# EAGLE design modul_analogin (EAGLE 7.7.0)

## Sheet 1 of 5
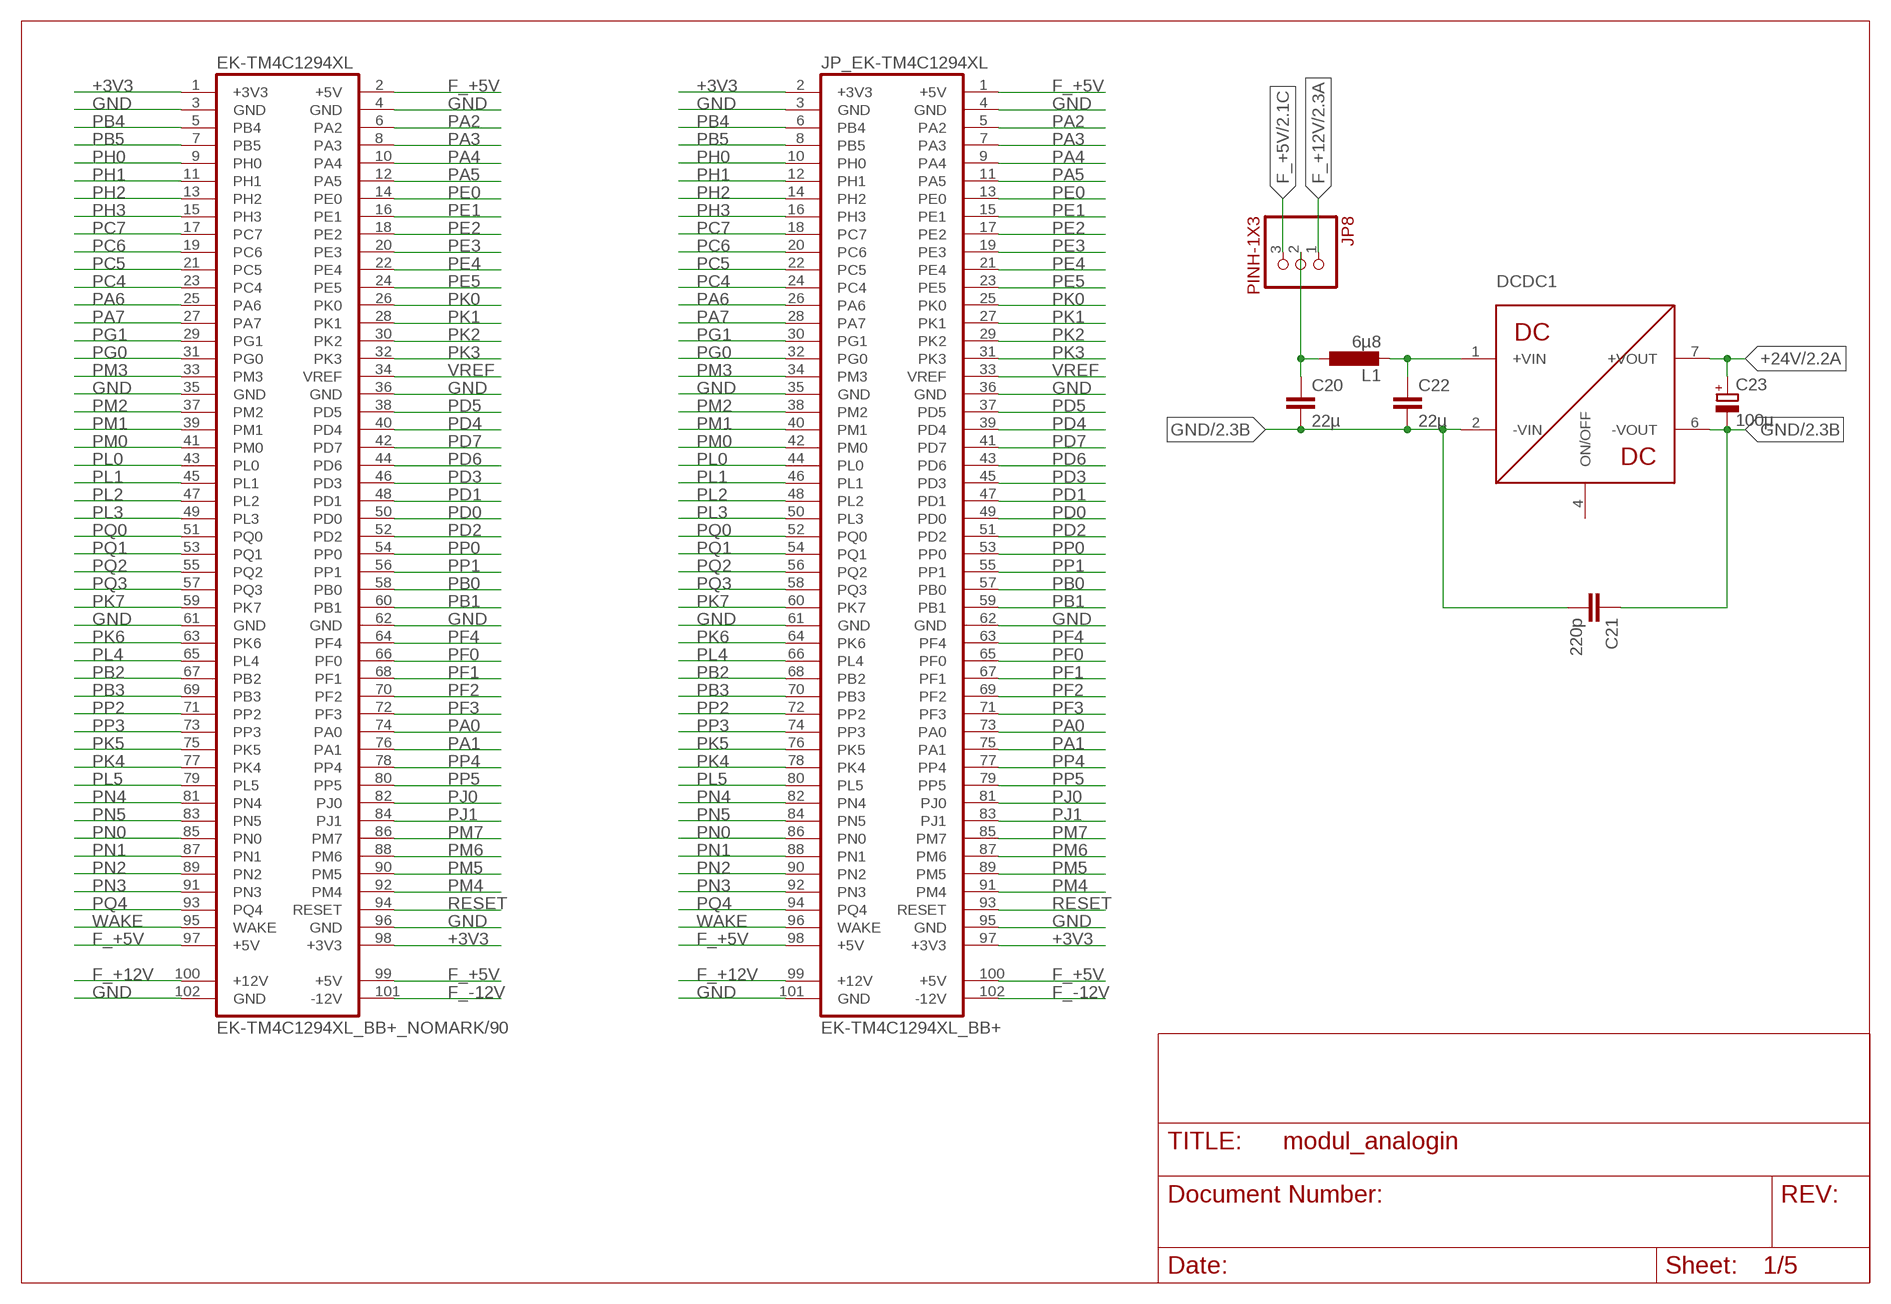
[diagram p0: schematic, sheet 1]

### Parts
C20  22µ  C-EUC1206  [C1206]
C21  220p  C-EUC1808  [C1808]
C22  22µ  C-EUC1206  [C1206]
C23  100µ  CPOL-EUE2.5-6  [E2,5-6]
DCDC1  TDN3WI  [TDN_XWI]
EK-TM4C1294XL  EK-TM4C1294XL_BB+_NOMARK/90  [EK-TM4C1294XL_BB+_NOMARK/90]
JP8  PINH-1X3  [1X3]
JP_EK-TM4C1294XL  EK-TM4C1294XL_BB+  [EK-TM4C1294XL_BB+]
L1  6µ8  L-EUL1812  [L1812]

### Nets
+3V3: EK-TM4C1294XL.1(+3V3) EK-TM4C1294XL.98(+3V3) JP_EK-TM4C1294XL.2(+3V3) JP_EK-TM4C1294XL.97(+3V3) ; also sheet 4,5
+24V: C23.+ DCDC1.7(+VOUT) ; also sheet 2
+VIN: C22.1 DCDC1.1(+VIN) L1.2
F_+5V: EK-TM4C1294XL.2(+5V) EK-TM4C1294XL.97(+5V) EK-TM4C1294XL.99(+5V) JP8.3 JP_EK-TM4C1294XL.1(+5V) JP_EK-TM4C1294XL.98(+5V) JP_EK-TM4C1294XL.100(+5V) ; also sheet 2,3
F_+12V: EK-TM4C1294XL.100(+12V) JP8.1 JP_EK-TM4C1294XL.99(+12V) ; also sheet 2,4,5
F_-12V: EK-TM4C1294XL.101(-12V) JP_EK-TM4C1294XL.102(-12V) ; also sheet 2,4,5
GND: C20.2 C21.1 C21.2 C22.2 C23.- DCDC1.2(-VIN) DCDC1.6(-VOUT) EK-TM4C1294XL.3(GND) EK-TM4C1294XL.4(GND) EK-TM4C1294XL.35(GND) EK-TM4C1294XL.36(GND) EK-TM4C1294XL.61(GND) EK-TM4C1294XL.62(GND) EK-TM4C1294XL.96(GND) EK-TM4C1294XL.102(GND) JP_EK-TM4C1294XL.3(GND) JP_EK-TM4C1294XL.4(GND) JP_EK-TM4C1294XL.35(GND) JP_EK-TM4C1294XL.36(GND) JP_EK-TM4C1294XL.61(GND) JP_EK-TM4C1294XL.62(GND) JP_EK-TM4C1294XL.95(GND) JP_EK-TM4C1294XL.101(GND) ; also sheet 2,3,4,5
N$24: C20.1 JP8.2 L1.1
PA0: EK-TM4C1294XL.74(PA0) JP_EK-TM4C1294XL.73(PA0)
PA1: EK-TM4C1294XL.76(PA1) JP_EK-TM4C1294XL.75(PA1)
PA2: EK-TM4C1294XL.6(PA2) JP_EK-TM4C1294XL.5(PA2)
PA3: EK-TM4C1294XL.8(PA3) JP_EK-TM4C1294XL.7(PA3)
PA4: EK-TM4C1294XL.10(PA4) JP_EK-TM4C1294XL.9(PA4)
PA5: EK-TM4C1294XL.12(PA5) JP_EK-TM4C1294XL.11(PA5)
PA6: EK-TM4C1294XL.25(PA6) JP_EK-TM4C1294XL.26(PA6)
PA7: EK-TM4C1294XL.27(PA7) JP_EK-TM4C1294XL.28(PA7)
PB0: EK-TM4C1294XL.58(PB0) JP_EK-TM4C1294XL.57(PB0)
PB1: EK-TM4C1294XL.60(PB1) JP_EK-TM4C1294XL.59(PB1)
PB2: EK-TM4C1294XL.67(PB2) JP_EK-TM4C1294XL.68(PB2)
PB3: EK-TM4C1294XL.69(PB3) JP_EK-TM4C1294XL.70(PB3)
PB4: EK-TM4C1294XL.5(PB4) JP_EK-TM4C1294XL.6(PB4) ; also sheet 3
PB5: EK-TM4C1294XL.7(PB5) JP_EK-TM4C1294XL.8(PB5) ; also sheet 3
PC4: EK-TM4C1294XL.23(PC4) JP_EK-TM4C1294XL.24(PC4)
PC5: EK-TM4C1294XL.21(PC5) JP_EK-TM4C1294XL.22(PC5)
PC6: EK-TM4C1294XL.19(PC6) JP_EK-TM4C1294XL.20(PC6)
PC7: EK-TM4C1294XL.17(PC7) JP_EK-TM4C1294XL.18(PC7)
PD0: EK-TM4C1294XL.50(PD0) JP_EK-TM4C1294XL.49(PD0) ; also sheet 3
PD1: EK-TM4C1294XL.48(PD1) JP_EK-TM4C1294XL.47(PD1) ; also sheet 3
PD2: EK-TM4C1294XL.52(PD2) JP_EK-TM4C1294XL.51(PD2) ; also sheet 3
PD3: EK-TM4C1294XL.46(PD3) JP_EK-TM4C1294XL.45(PD3) ; also sheet 3
PD4: EK-TM4C1294XL.40(PD4) JP_EK-TM4C1294XL.39(PD4) ; also sheet 3
PD5: EK-TM4C1294XL.38(PD5) JP_EK-TM4C1294XL.37(PD5) ; also sheet 3
PD6: EK-TM4C1294XL.44(PD6) JP_EK-TM4C1294XL.43(PD6) ; also sheet 3
PD7: EK-TM4C1294XL.42(PD7) JP_EK-TM4C1294XL.41(PD7) ; also sheet 3
PE0: EK-TM4C1294XL.14(PE0) JP_EK-TM4C1294XL.13(PE0) ; also sheet 3
PE1: EK-TM4C1294XL.16(PE1) JP_EK-TM4C1294XL.15(PE1) ; also sheet 3
PE2: EK-TM4C1294XL.18(PE2) JP_EK-TM4C1294XL.17(PE2) ; also sheet 3
PE3: EK-TM4C1294XL.20(PE3) JP_EK-TM4C1294XL.19(PE3) ; also sheet 3
PE4: EK-TM4C1294XL.22(PE4) JP_EK-TM4C1294XL.21(PE4) ; also sheet 3
PE5: EK-TM4C1294XL.24(PE5) JP_EK-TM4C1294XL.23(PE5) ; also sheet 3
PF0: EK-TM4C1294XL.66(PF0) JP_EK-TM4C1294XL.65(PF0)
PF1: EK-TM4C1294XL.68(PF1) JP_EK-TM4C1294XL.67(PF1)
PF2: EK-TM4C1294XL.70(PF2) JP_EK-TM4C1294XL.69(PF2)
PF3: EK-TM4C1294XL.72(PF3) JP_EK-TM4C1294XL.71(PF3)
PF4: EK-TM4C1294XL.64(PF4) JP_EK-TM4C1294XL.63(PF4)
PG0: EK-TM4C1294XL.31(PG0) JP_EK-TM4C1294XL.32(PG0)
PG1: EK-TM4C1294XL.29(PG1) JP_EK-TM4C1294XL.30(PG1)
PH0: EK-TM4C1294XL.9(PH0) JP_EK-TM4C1294XL.10(PH0)
PH1: EK-TM4C1294XL.11(PH1) JP_EK-TM4C1294XL.12(PH1)
PH2: EK-TM4C1294XL.13(PH2) JP_EK-TM4C1294XL.14(PH2)
PH3: EK-TM4C1294XL.15(PH3) JP_EK-TM4C1294XL.16(PH3)
PJ0: EK-TM4C1294XL.82(PJ0) JP_EK-TM4C1294XL.81(PJ0)
PJ1: EK-TM4C1294XL.84(PJ1) JP_EK-TM4C1294XL.83(PJ1)
PK0: EK-TM4C1294XL.26(PK0) JP_EK-TM4C1294XL.25(PK0)
PK1: EK-TM4C1294XL.28(PK1) JP_EK-TM4C1294XL.27(PK1)
PK2: EK-TM4C1294XL.30(PK2) JP_EK-TM4C1294XL.29(PK2)
PK3: EK-TM4C1294XL.32(PK3) JP_EK-TM4C1294XL.31(PK3)
PK4: EK-TM4C1294XL.77(PK4) JP_EK-TM4C1294XL.78(PK4)
PK5: EK-TM4C1294XL.75(PK5) JP_EK-TM4C1294XL.76(PK5)
PK6: EK-TM4C1294XL.63(PK6) JP_EK-TM4C1294XL.64(PK6)
PK7: EK-TM4C1294XL.59(PK7) JP_EK-TM4C1294XL.60(PK7)
PL0: EK-TM4C1294XL.43(PL0) JP_EK-TM4C1294XL.44(PL0)
PL1: EK-TM4C1294XL.45(PL1) JP_EK-TM4C1294XL.46(PL1)
PL2: EK-TM4C1294XL.47(PL2) JP_EK-TM4C1294XL.48(PL2)
PL3: EK-TM4C1294XL.49(PL3) JP_EK-TM4C1294XL.50(PL3)
PL4: EK-TM4C1294XL.65(PL4) JP_EK-TM4C1294XL.66(PL4)
PL5: EK-TM4C1294XL.79(PL5) JP_EK-TM4C1294XL.80(PL5)
PM0: EK-TM4C1294XL.41(PM0) JP_EK-TM4C1294XL.42(PM0)
PM1: EK-TM4C1294XL.39(PM1) JP_EK-TM4C1294XL.40(PM1)
PM2: EK-TM4C1294XL.37(PM2) JP_EK-TM4C1294XL.38(PM2)
PM3: EK-TM4C1294XL.33(PM3) JP_EK-TM4C1294XL.34(PM3)
PM4: EK-TM4C1294XL.92(PM4) JP_EK-TM4C1294XL.91(PM4)
PM5: EK-TM4C1294XL.90(PM5) JP_EK-TM4C1294XL.89(PM5)
PM6: EK-TM4C1294XL.88(PM6) JP_EK-TM4C1294XL.87(PM6)
PM7: EK-TM4C1294XL.86(PM7) JP_EK-TM4C1294XL.85(PM7)
PN0: EK-TM4C1294XL.85(PN0) JP_EK-TM4C1294XL.86(PN0)
PN1: EK-TM4C1294XL.87(PN1) JP_EK-TM4C1294XL.88(PN1)
PN2: EK-TM4C1294XL.89(PN2) JP_EK-TM4C1294XL.90(PN2)
PN3: EK-TM4C1294XL.91(PN3) JP_EK-TM4C1294XL.92(PN3)
PN4: EK-TM4C1294XL.81(PN4) JP_EK-TM4C1294XL.82(PN4)
PN5: EK-TM4C1294XL.83(PN5) JP_EK-TM4C1294XL.84(PN5)
PP0: EK-TM4C1294XL.54(PP0) JP_EK-TM4C1294XL.53(PP0)
PP1: EK-TM4C1294XL.56(PP1) JP_EK-TM4C1294XL.55(PP1)
PP2: EK-TM4C1294XL.71(PP2) JP_EK-TM4C1294XL.72(PP2)
PP3: EK-TM4C1294XL.73(PP3) JP_EK-TM4C1294XL.74(PP3)
PP4: EK-TM4C1294XL.78(PP4) JP_EK-TM4C1294XL.77(PP4)
PP5: EK-TM4C1294XL.80(PP5) JP_EK-TM4C1294XL.79(PP5)
PQ0: EK-TM4C1294XL.51(PQ0) JP_EK-TM4C1294XL.52(PQ0)
PQ1: EK-TM4C1294XL.53(PQ1) JP_EK-TM4C1294XL.54(PQ1)
PQ2: EK-TM4C1294XL.55(PQ2) JP_EK-TM4C1294XL.56(PQ2)
PQ3: EK-TM4C1294XL.57(PQ3) JP_EK-TM4C1294XL.58(PQ3)
PQ4: EK-TM4C1294XL.93(PQ4) JP_EK-TM4C1294XL.94(PQ4)
RESET: EK-TM4C1294XL.94(RESET) JP_EK-TM4C1294XL.93(RESET)
VREF: EK-TM4C1294XL.34(VREF) JP_EK-TM4C1294XL.33(VREF)
WAKE: EK-TM4C1294XL.95(WAKE) JP_EK-TM4C1294XL.96(WAKE)
Unconnected: DCDC1.4(ON/OFF)

## Sheet 2 of 5
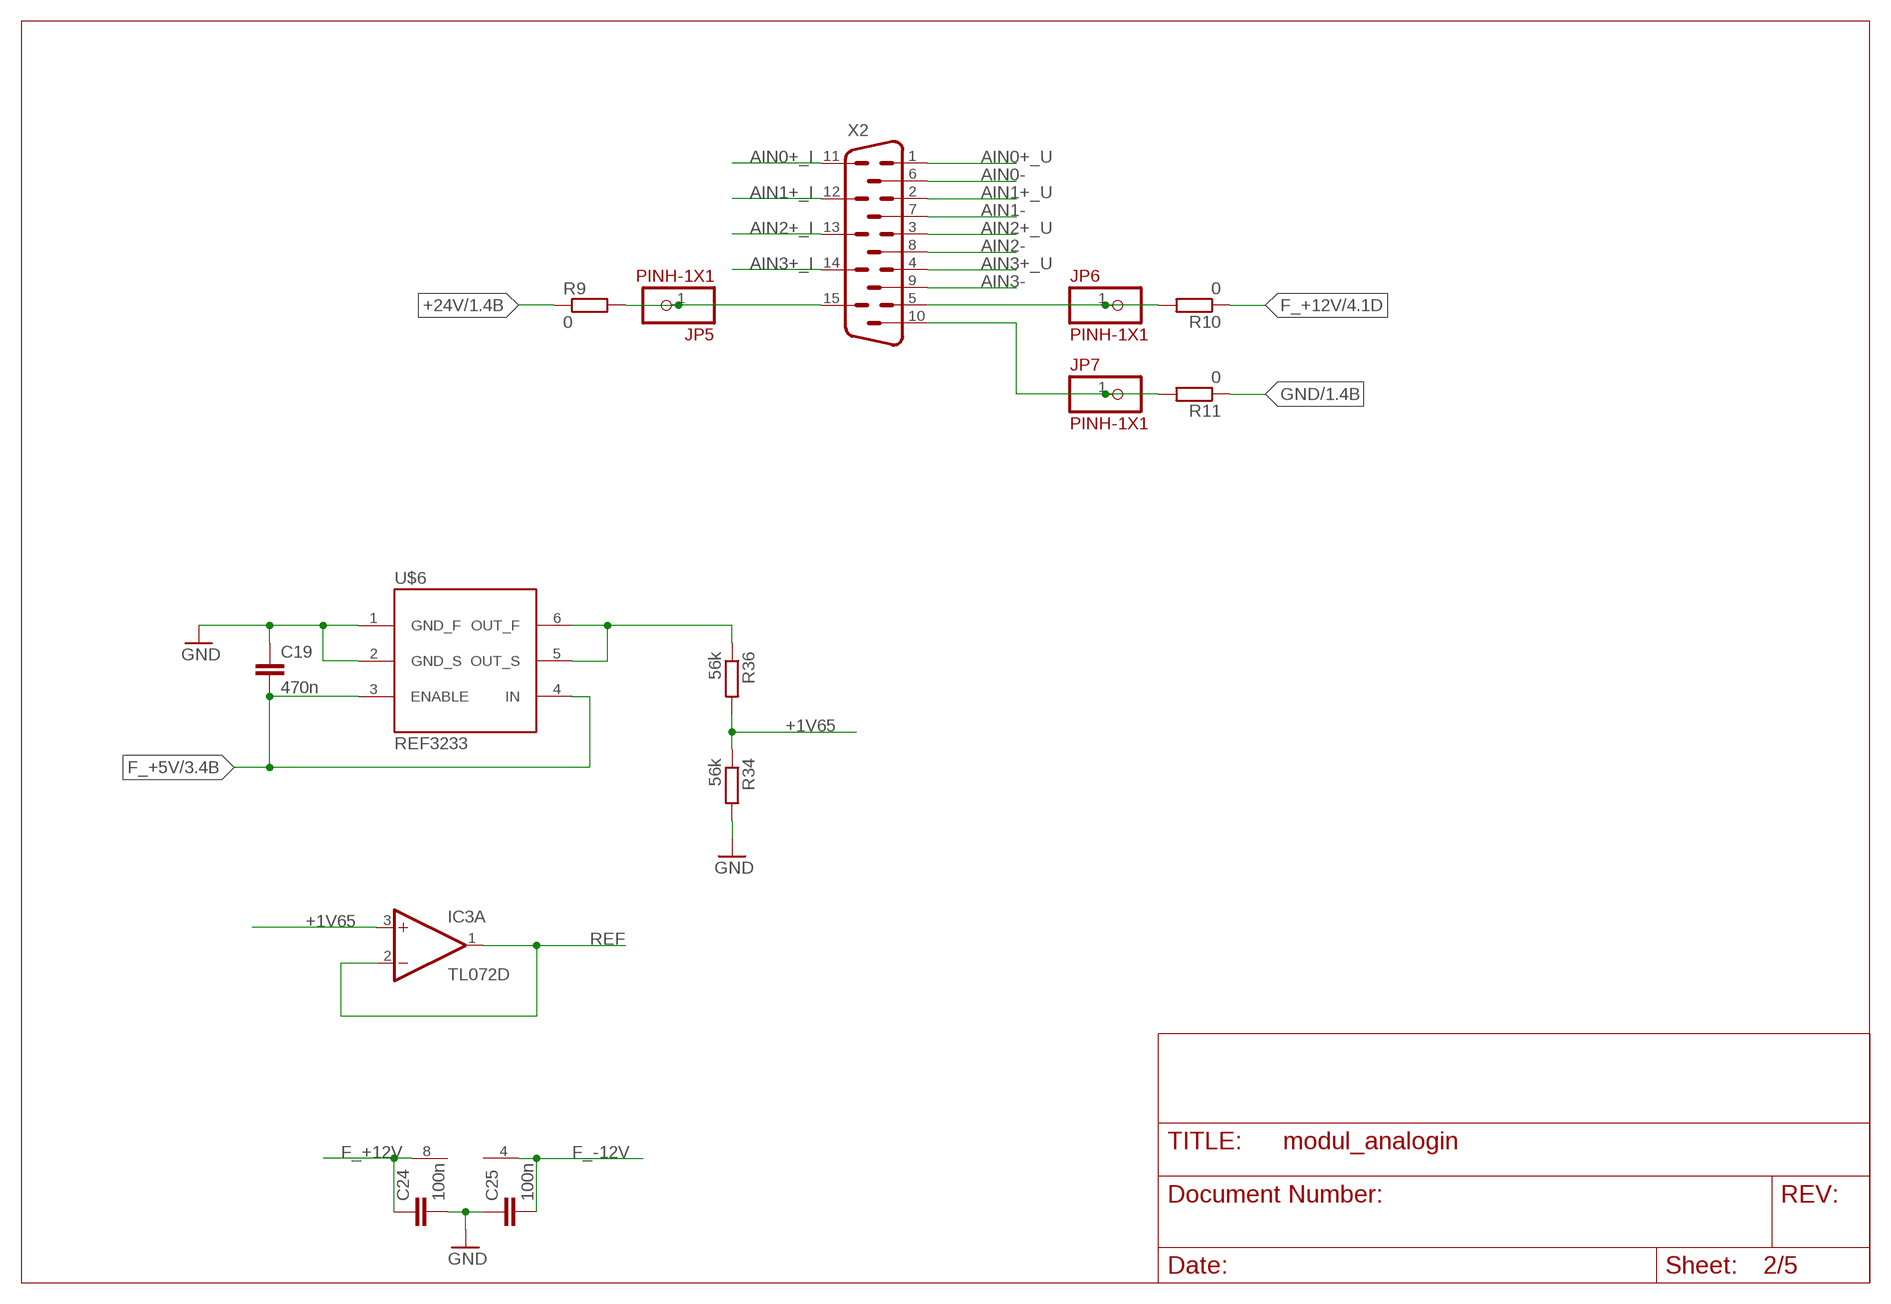
[diagram p1: schematic, sheet 2]

### Parts
C19  470n  C-EUC0805  [C0805]
C24  100n  C-EUC0805  [C0805]
C25  100n  C-EUC0805  [C0805]
IC3  TL072D  [SO08]
JP5  PINH-1X1  [1X1]
JP6  PINH-1X1  [1X1]
JP7  PINH-1X1  [1X1]
R9  0  R-EU_R0805  [R0805]
R10  0  R-EU_R0805  [R0805]
R11  0  R-EU_R0805  [R0805]
R34  56k  R-EU_R0805  [R0805]
R36  56k  R-EU_R0805  [R0805]
U$6  REF3233  [SOT-23-6_DBV]
X2  HM15H  [HDM15H]

### Nets
+1V65: IC3.3(A:+IN) R34.1 R36.2
+24V: R9.1 ; also sheet 1
AIN0+_I: X2.11 ; also sheet 4
AIN0+_U: X2.1 ; also sheet 4
AIN0-: X2.6 ; also sheet 4
AIN1+_I: X2.12 ; also sheet 4
AIN1+_U: X2.2 ; also sheet 4
AIN1-: X2.7 ; also sheet 4
AIN2+_I: X2.13 ; also sheet 5
AIN2+_U: X2.3 ; also sheet 5
AIN2-: X2.8 ; also sheet 5
AIN3+_I: X2.14 ; also sheet 5
AIN3+_U: X2.4 ; also sheet 5
AIN3-: X2.9 ; also sheet 5
F_+5V: C19.2 U$6.3(ENABLE) U$6.4(IN) ; also sheet 1,3
F_+12V: C24.1 IC3.8(P:V+) R10.1 ; also sheet 1,4,5
F_-12V: C25.2 IC3.4(P:V-) ; also sheet 1,4,5
GND: C19.1 C24.2 C25.1 R11.1 R34.2 U$6.1(GND_F) U$6.2(GND_S) ; also sheet 1,3,4,5
N$4: R36.1 U$6.5(OUT_S) U$6.6(OUT_F)
REF: IC3.1(A:OUT) IC3.2(A:-IN) ; also sheet 4,5
SUP_1: JP5.1 R9.2 X2.15
SUP_2: JP6.1 R10.2 X2.5
SUP_3: JP7.1 R11.2 X2.10
Unconnected: IC3.5(B:+IN) IC3.6(B:-IN) IC3.7(B:OUT)

## Sheet 3 of 5
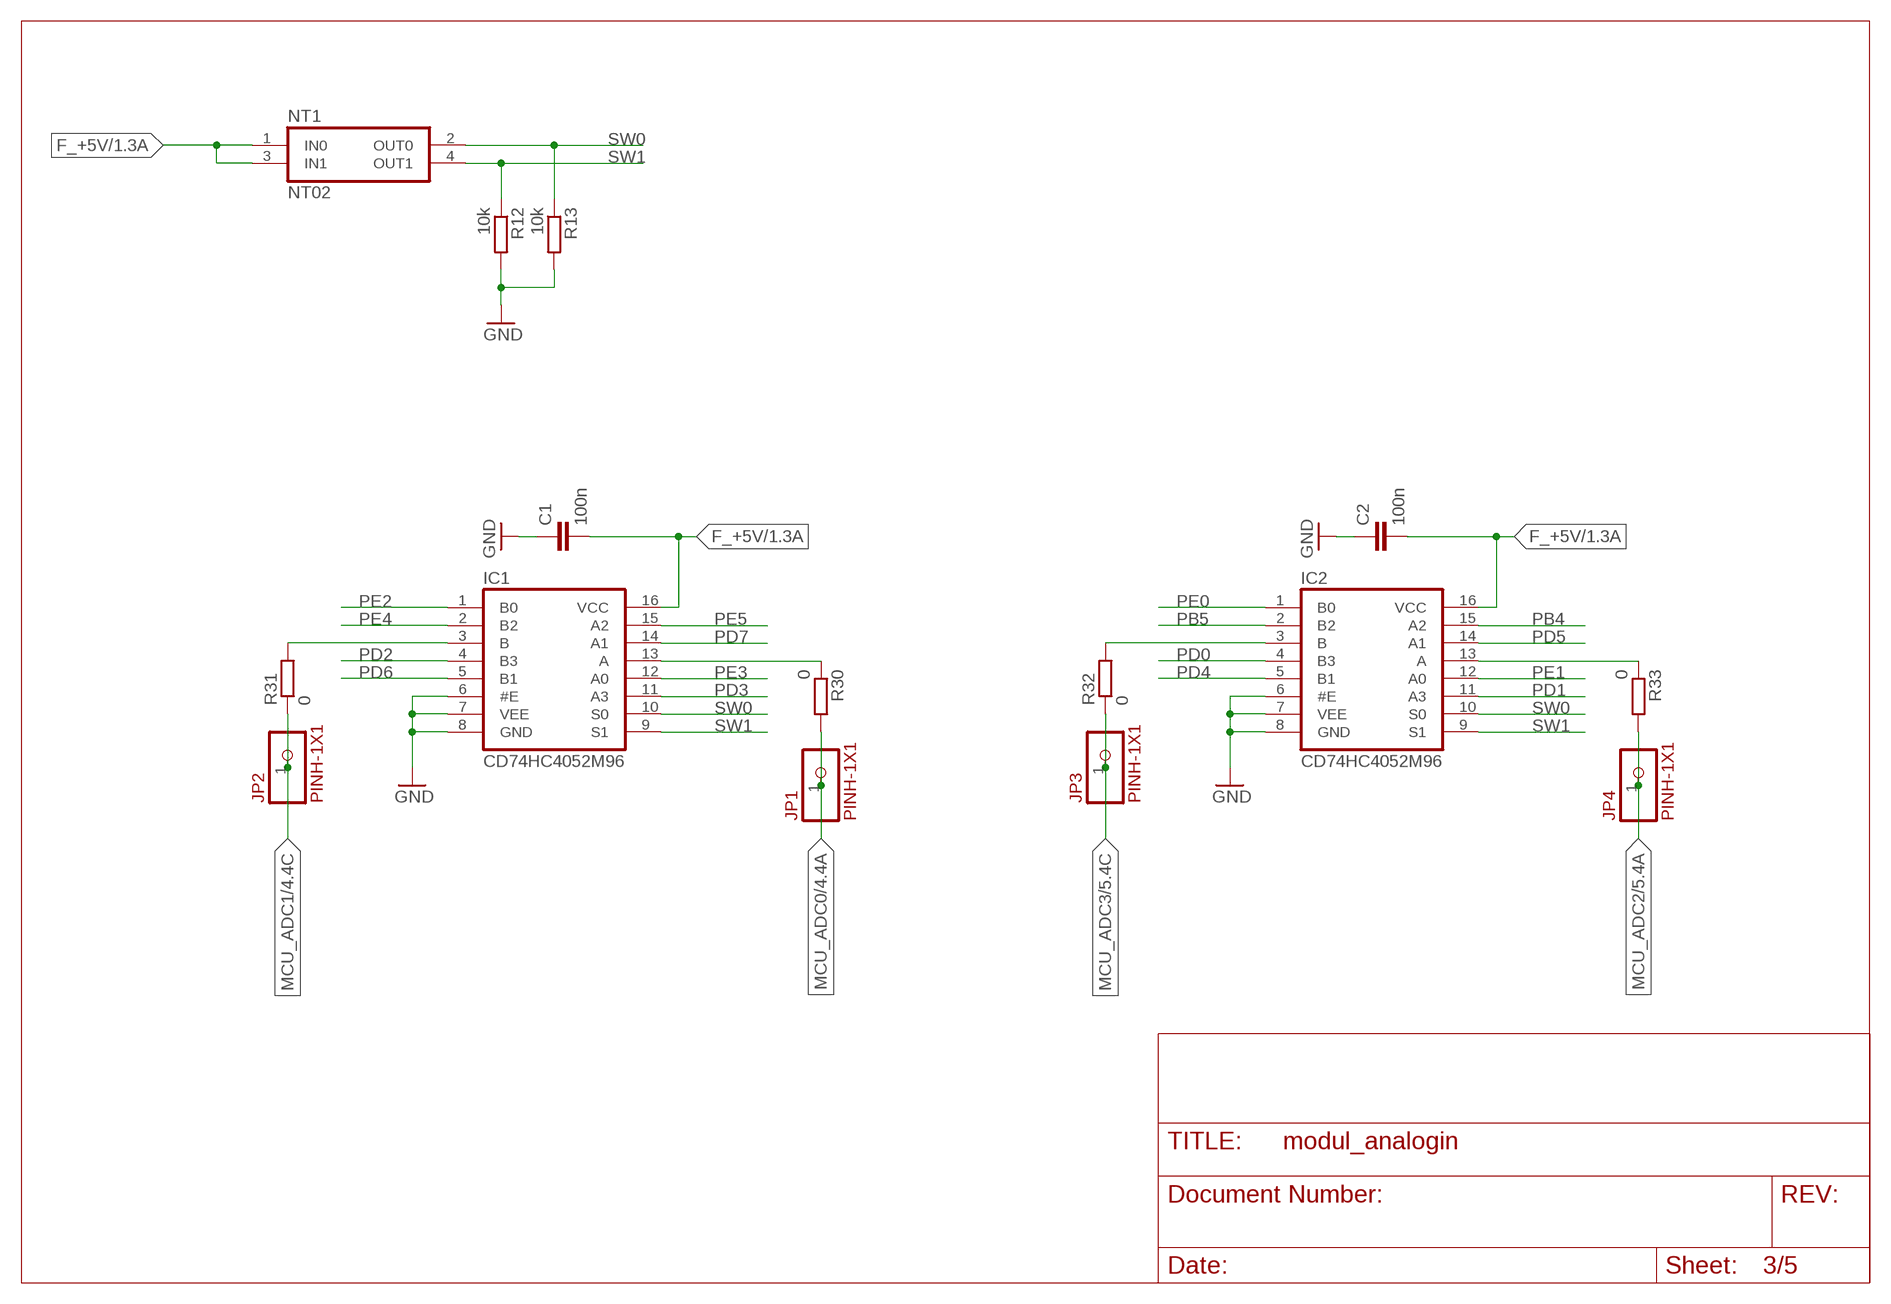
[diagram p2: schematic, sheet 3]

### Parts
C1  100n  C-EUC0805  [C0805]
C2  100n  C-EUC0805  [C0805]
IC1  CD74HC4052M96  [SOIC16_D]
IC2  CD74HC4052M96  [SOIC16_D]
JP1  PINH-1X1  [1X1]
JP2  PINH-1X1  [1X1]
JP3  PINH-1X1  [1X1]
JP4  PINH-1X1  [1X1]
NT1  NT02  [NT02]
R12  10k  R-EU_R0805  [R0805]
R13  10k  R-EU_R0805  [R0805]
R30  0  R-EU_R0805  [R0805]
R31  0  R-EU_R0805  [R0805]
R32  0  R-EU_R0805  [R0805]
R33  0  R-EU_R0805  [R0805]

### Nets
F_+5V: C1.2 C2.2 IC1.16(VCC) IC2.16(VCC) NT1.1(IN0) NT1.3(IN1) ; also sheet 1,2
GND: C1.1 C2.1 IC1.6(#E) IC1.7(VEE) IC1.8(GND) IC2.6(#E) IC2.7(VEE) IC2.8(GND) R12.2 R13.2 ; also sheet 1,2,4,5
MCU_ADC0: JP1.1 R30.2 ; also sheet 4
MCU_ADC1: JP2.1 R31.1 ; also sheet 4
MCU_ADC2: JP4.1 R33.2 ; also sheet 5
MCU_ADC3: JP3.1 R32.1 ; also sheet 5
N$28: IC1.13(A) R30.1
N$29: IC2.3(B) R32.2
N$30: IC1.3(B) R31.2
N$31: IC2.13(A) R33.1
PB4: IC2.15(A2) ; also sheet 1
PB5: IC2.2(B2) ; also sheet 1
PD0: IC2.4(B3) ; also sheet 1
PD1: IC2.11(A3) ; also sheet 1
PD2: IC1.4(B3) ; also sheet 1
PD3: IC1.11(A3) ; also sheet 1
PD4: IC2.5(B1) ; also sheet 1
PD5: IC2.14(A1) ; also sheet 1
PD6: IC1.5(B1) ; also sheet 1
PD7: IC1.14(A1) ; also sheet 1
PE0: IC2.1(B0) ; also sheet 1
PE1: IC2.12(A0) ; also sheet 1
PE2: IC1.1(B0) ; also sheet 1
PE3: IC1.12(A0) ; also sheet 1
PE4: IC1.2(B2) ; also sheet 1
PE5: IC1.15(A2) ; also sheet 1
SW0: IC1.10(S0) IC2.10(S0) NT1.2(OUT0) R13.1
SW1: IC1.9(S1) IC2.9(S1) NT1.4(OUT1) R12.1

## Sheet 4 of 5
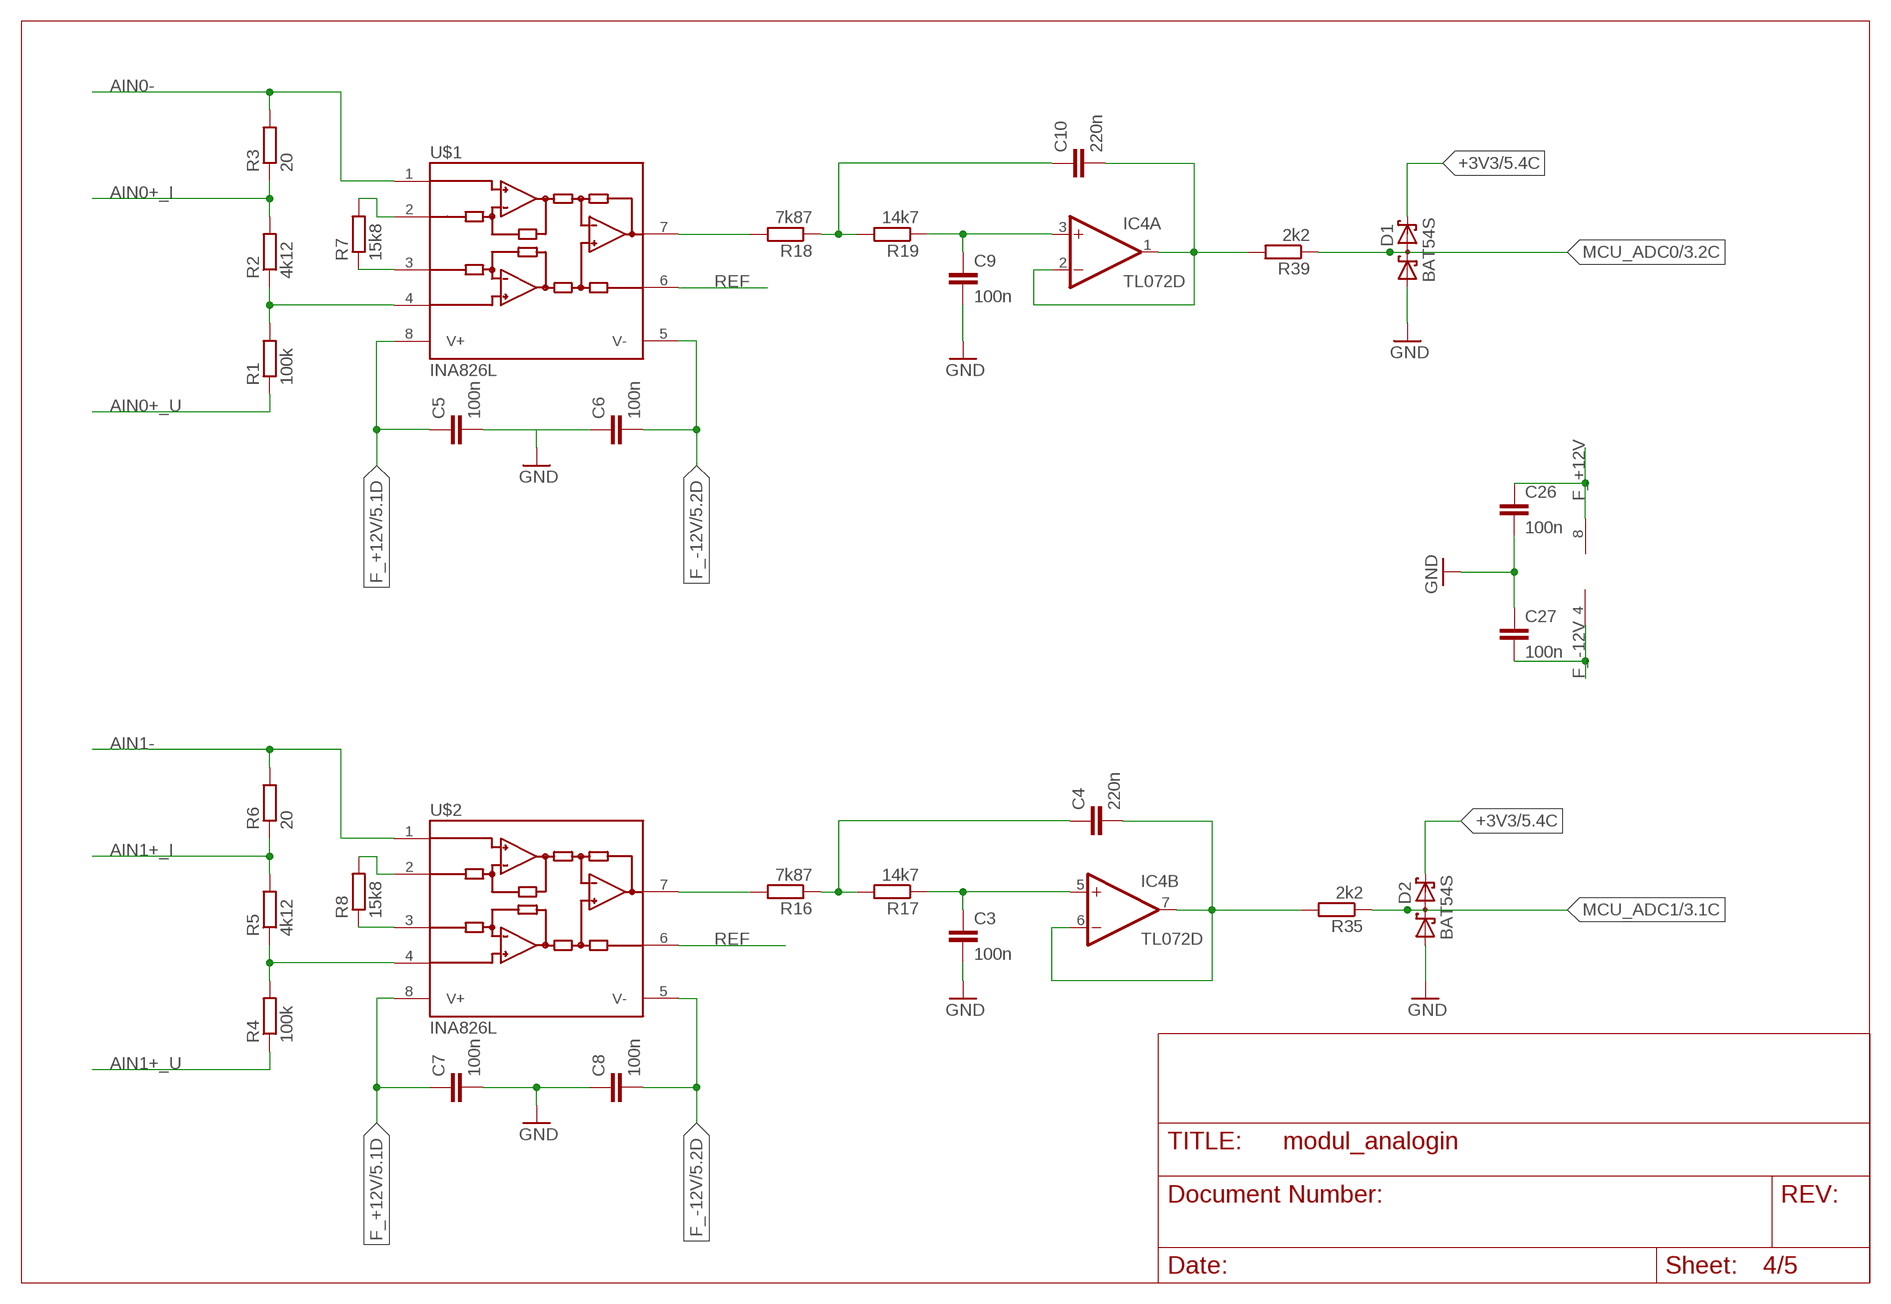
[diagram p3: schematic, sheet 4]

### Parts
C3  100n  C-EUC0805  [C0805]
C4  220n  C-EUC0805  [C0805]
C5  100n  C-EUC0805  [C0805]
C6  100n  C-EUC0805  [C0805]
C7  100n  C-EUC0805  [C0805]
C8  100n  C-EUC0805  [C0805]
C9  100n  C-EUC0805  [C0805]
C10  220n  C-EUC0805  [C0805]
C26  100n  C-EUC0805  [C0805]
C27  100n  C-EUC0805  [C0805]
D1  BAT54S  [SOT23]
D2  BAT54S  [SOT23]
IC4  TL072D  [SO08]
R1  100k  R-EU_R0805  [R0805]
R2  4k12  R-EU_R0805  [R0805]
R3  20  R-EU_R0805  [R0805]
R4  100k  R-EU_R0805  [R0805]
R5  4k12  R-EU_R0805  [R0805]
R6  20  R-EU_R0805  [R0805]
R7  15k8  R-EU_R0805  [R0805]
R8  15k8  R-EU_R0805  [R0805]
R16  7k87  R-EU_R0805  [R0805]
R17  14k7  R-EU_R0805  [R0805]
R18  7k87  R-EU_R0805  [R0805]
R19  14k7  R-EU_R0805  [R0805]
R35  2k2  R-EU_R0805  [R0805]
R39  2k2  R-EU_R0805  [R0805]
U$1  INA826L  [DGK_S-PDSO-G8]
U$2  INA826L  [DGK_S-PDSO-G8]

### Nets
+3V3: D1.2(C2) D2.2(C2) ; also sheet 1,5
AIN0+_I: R2.2 R3.1 ; also sheet 2
AIN0+_U: R1.1 ; also sheet 2
AIN0-: R3.2 U$1.1(-IN) ; also sheet 2
AIN1+_I: R5.2 R6.1 ; also sheet 2
AIN1+_U: R4.1 ; also sheet 2
AIN1-: R6.2 U$2.1(-IN) ; also sheet 2
F_+12V: C5.1 C7.1 C26.1 IC4.8(P:V+) U$1.8(V+) U$2.8(V+) ; also sheet 1,2,5
F_-12V: C6.2 C8.2 C27.2 IC4.4(P:V-) U$1.5(V-) U$2.5(V-) ; also sheet 1,2,5
GND: C3.2 C7.2 C8.1 C9.2 C26.2 C27.1 D1.1(A1) D2.1(A1) ; also sheet 1,2,3,5
MCU_ADC0: D1.3(C1A2) R39.1 ; also sheet 3
MCU_ADC1: D2.3(C1A2) R35.1 ; also sheet 3
N$1: C9.1 IC4.3(A:+IN) R19.1
N$8: R7.1 U$1.3(J)
N$9: R7.2 U$1.2(J)
N$10: R8.1 U$2.3(J)
N$11: R8.2 U$2.2(J)
N$12: C5.2 C6.1
N$13: R4.2 R5.1 U$2.4(+IN)
N$17: R16.2 U$2.7(OUT)
N$18: C4.1 R16.1 R17.2
N$20: R18.2 U$1.7(OUT)
N$21: C10.1 R18.1 R19.2
N$22: C3.1 IC4.5(B:+IN) R17.1
N$34: R1.2 R2.1 U$1.4(+IN)
N$35: C10.2 IC4.1(A:OUT) IC4.2(A:-IN) R39.2
N$36: C4.2 IC4.6(B:-IN) IC4.7(B:OUT) R35.2
REF: U$1.6(REF) U$2.6(REF) ; also sheet 2,5

## Sheet 5 of 5
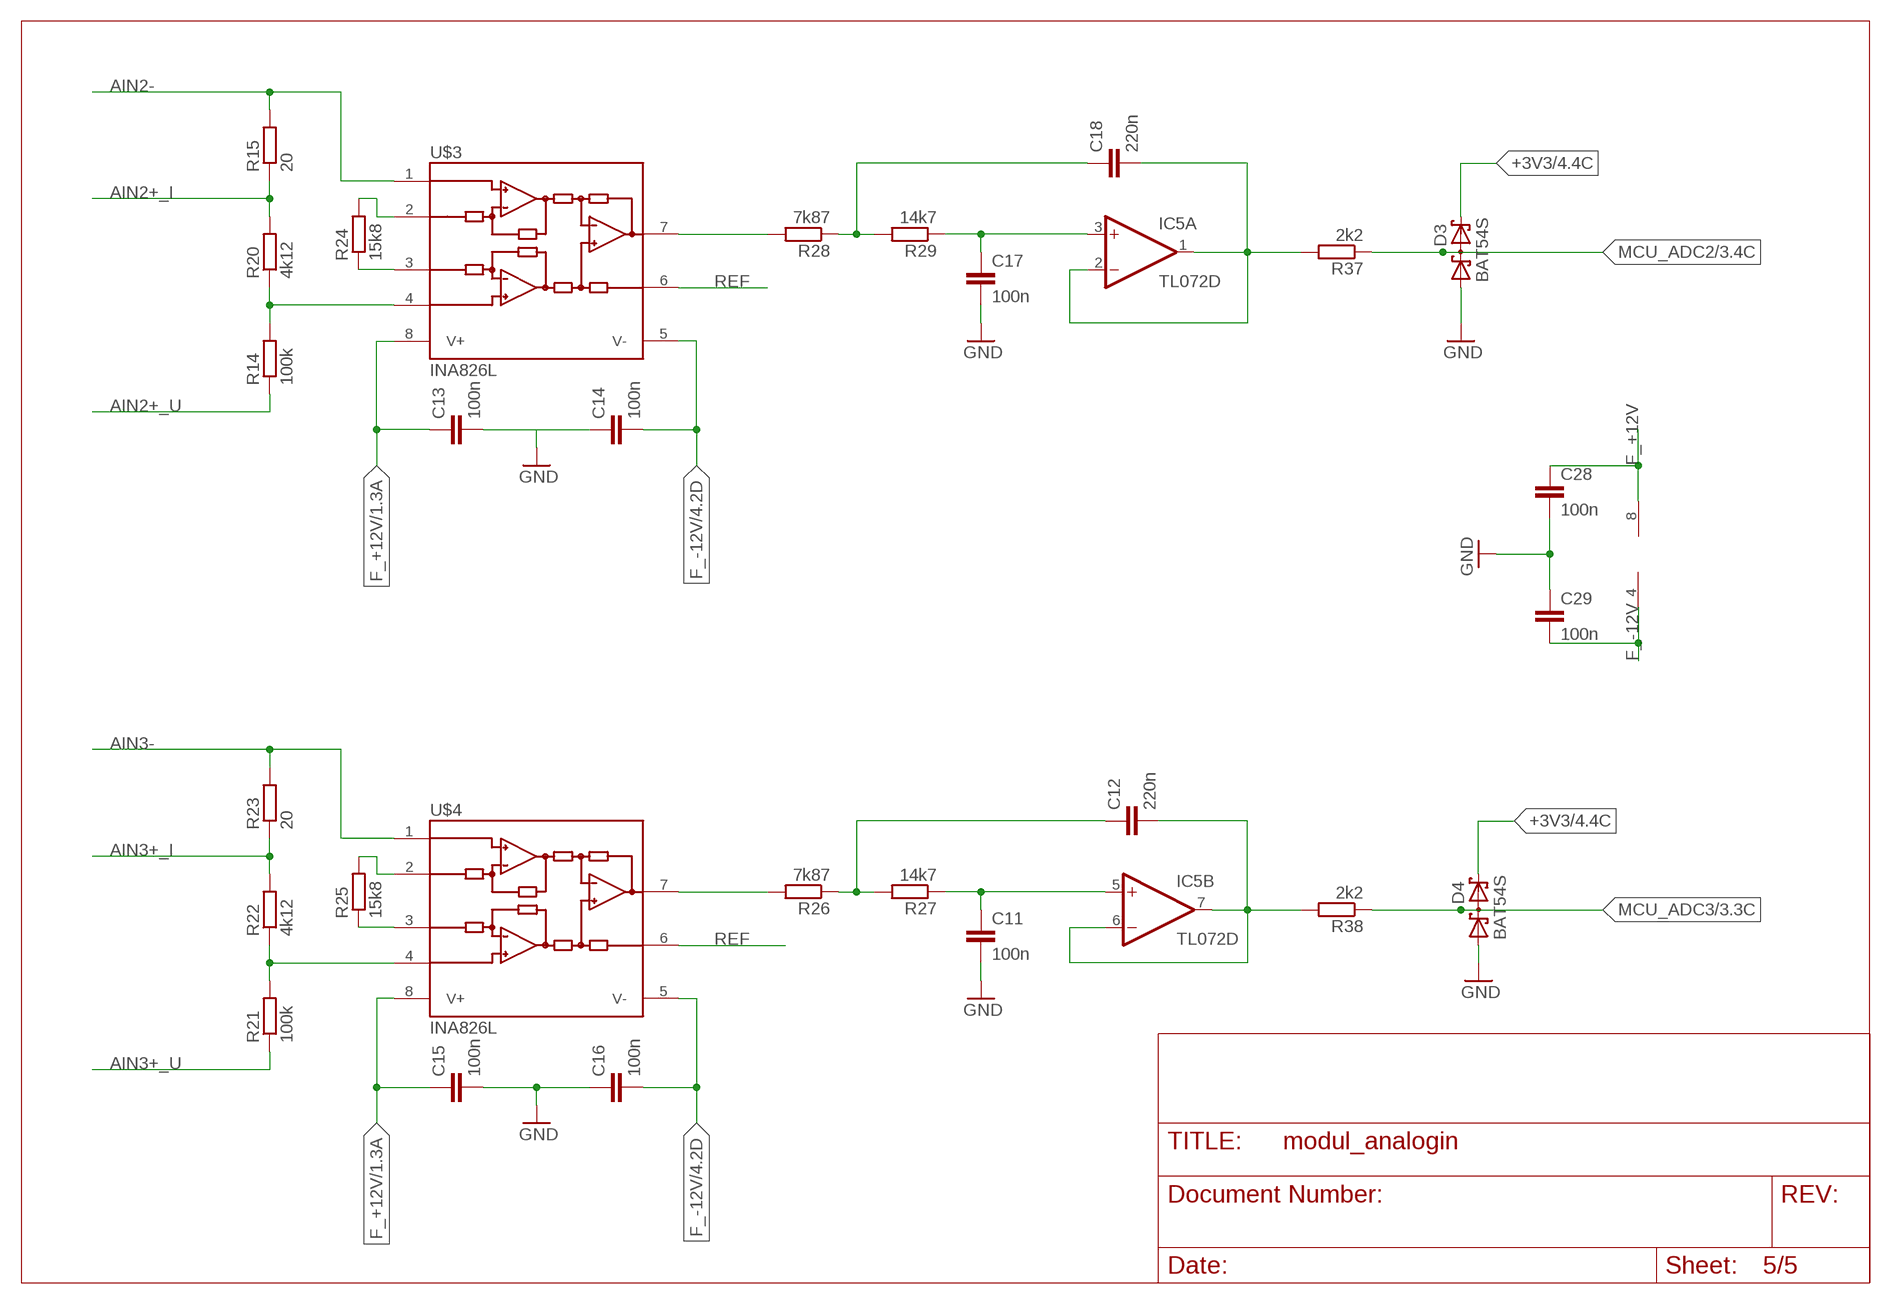
[diagram p4: schematic, sheet 5]

### Parts
C11  100n  C-EUC0805  [C0805]
C12  220n  C-EUC0805  [C0805]
C13  100n  C-EUC0805  [C0805]
C14  100n  C-EUC0805  [C0805]
C15  100n  C-EUC0805  [C0805]
C16  100n  C-EUC0805  [C0805]
C17  100n  C-EUC0805  [C0805]
C18  220n  C-EUC0805  [C0805]
C28  100n  C-EUC0805  [C0805]
C29  100n  C-EUC0805  [C0805]
D3  BAT54S  [SOT23]
D4  BAT54S  [SOT23]
IC5  TL072D  [SO08]
R14  100k  R-EU_R0805  [R0805]
R15  20  R-EU_R0805  [R0805]
R20  4k12  R-EU_R0805  [R0805]
R21  100k  R-EU_R0805  [R0805]
R22  4k12  R-EU_R0805  [R0805]
R23  20  R-EU_R0805  [R0805]
R24  15k8  R-EU_R0805  [R0805]
R25  15k8  R-EU_R0805  [R0805]
R26  7k87  R-EU_R0805  [R0805]
R27  14k7  R-EU_R0805  [R0805]
R28  7k87  R-EU_R0805  [R0805]
R29  14k7  R-EU_R0805  [R0805]
R37  2k2  R-EU_R0805  [R0805]
R38  2k2  R-EU_R0805  [R0805]
U$3  INA826L  [DGK_S-PDSO-G8]
U$4  INA826L  [DGK_S-PDSO-G8]

### Nets
+3V3: D3.2(C2) D4.2(C2) ; also sheet 1,4
AIN2+_I: R15.1 R20.2 ; also sheet 2
AIN2+_U: R14.1 ; also sheet 2
AIN2-: R15.2 U$3.1(-IN) ; also sheet 2
AIN3+_I: R22.2 R23.1 ; also sheet 2
AIN3+_U: R21.1 ; also sheet 2
AIN3-: R23.2 U$4.1(-IN) ; also sheet 2
F_+12V: C13.1 C15.1 C28.1 IC5.8(P:V+) U$3.8(V+) U$4.8(V+) ; also sheet 1,2,4
F_-12V: C14.2 C16.2 C29.2 IC5.4(P:V-) U$3.5(V-) U$4.5(V-) ; also sheet 1,2,4
GND: C11.2 C15.2 C16.1 C17.2 C28.2 C29.1 D3.1(A1) D4.1(A1) ; also sheet 1,2,3,4
MCU_ADC2: D3.3(C1A2) R37.1 ; also sheet 3
MCU_ADC3: D4.3(C1A2) R38.1 ; also sheet 3
N$2: R14.2 R20.1 U$3.4(+IN)
N$3: R24.1 U$3.3(J)
N$5: R24.2 U$3.2(J)
N$6: C13.2 C14.1
N$7: R25.1 U$4.3(J)
N$14: R25.2 U$4.2(J)
N$15: R21.2 R22.1 U$4.4(+IN)
N$16: R26.2 U$4.7(OUT)
N$19: C17.1 IC5.3(A:+IN) R29.1
N$23: C12.1 R26.1 R27.2
N$25: R28.2 U$3.7(OUT)
N$26: C18.1 R28.1 R29.2
N$27: C11.1 IC5.5(B:+IN) R27.1
N$32: C12.2 IC5.6(B:-IN) IC5.7(B:OUT) R38.2
N$33: C18.2 IC5.1(A:OUT) IC5.2(A:-IN) R37.2
REF: U$3.6(REF) U$4.6(REF) ; also sheet 2,4

## Library data of the parts
C1-C19 C24-C29 = resistor:C-EU: CAPACITOR, European symbol
C20-C22 = rcl:C-EU: CAPACITOR, European symbol
C23 = rcl:CPOL-EU: POLARIZED CAPACITOR, European symbol
D1-D4 = diode:BAT54S: Schottky Diodes Pin connection corrected 2011-05-04 Source: Fairchild .. BAT54.pdf
DCDC1 = ownparts:TDN3WI
EK-TM4C1294XL JP_EK-TM4C1294XL = ownparts:EK-TM4C1294XL_BB+
IC1 IC2 = ownparts:CD74HC4052*
IC3-IC5 = linear:TL072: OP AMP
JP1-JP7 = ownparts:PINH-1X1*: 1x1 pol. Stiftleisten, RM 2.54
JP8 = ownparts:PINH-1X3*: 1x3 pol. Stiftleisten, RM 2.54
L1 = rcl:L-EU: INDUCTOR, European symbol
NT1 = ownparts:NT02
R1-R39 = resistor:R-EU_: RESISTOR, European symbol
U$1-U$4 = Texas_Instruments:INA826
U$6 = ownparts:REF3233
X2 = con-subd:HM15: SUB-D; OC_FARNELL: unknown; OC_NEWARK: unknown

## Board
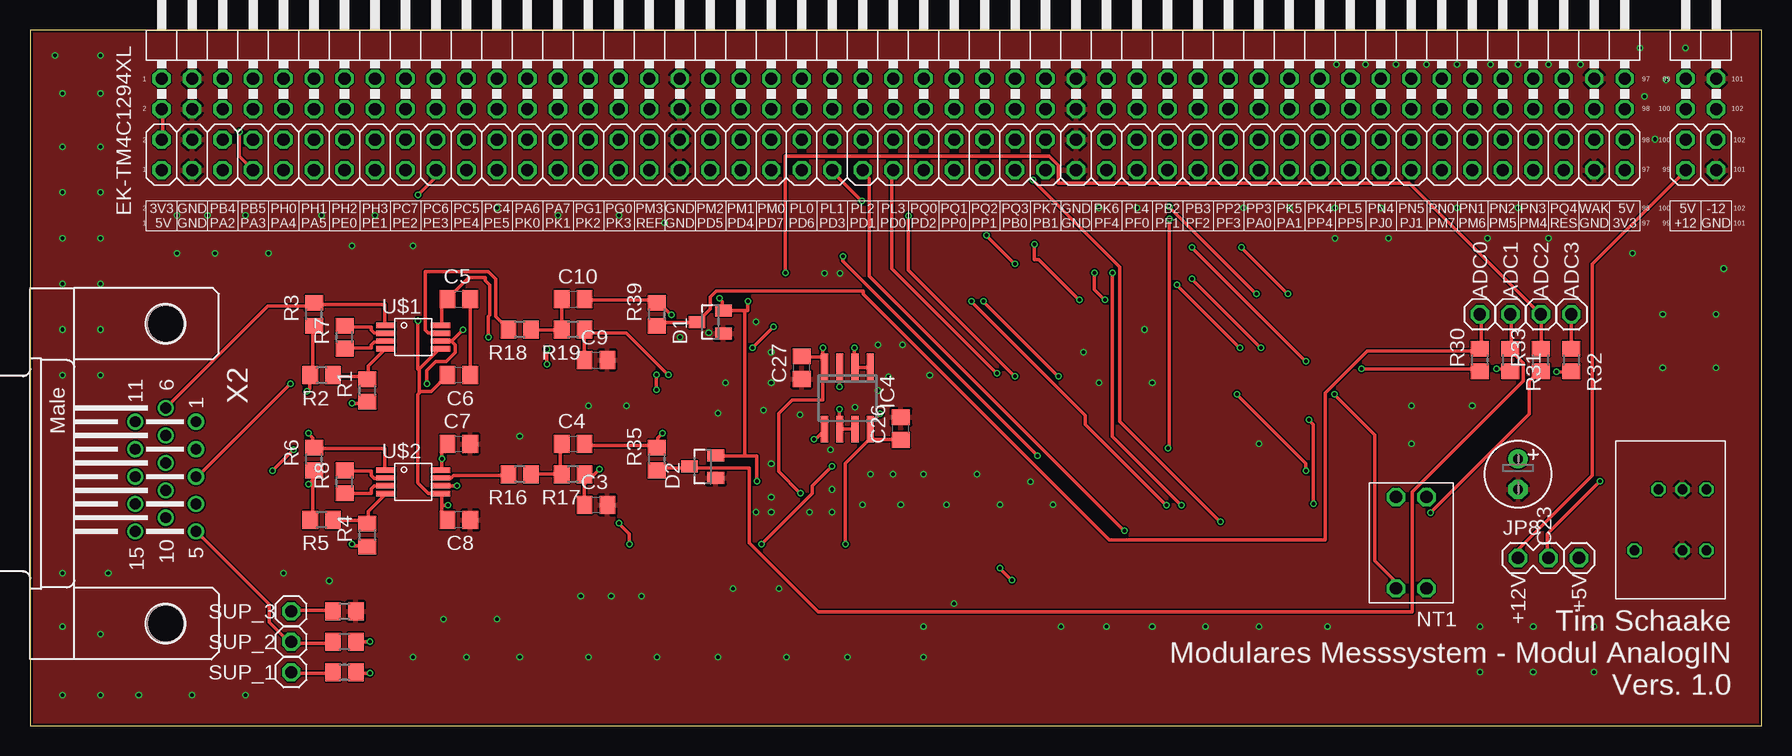
[diagram p5: board, top side]
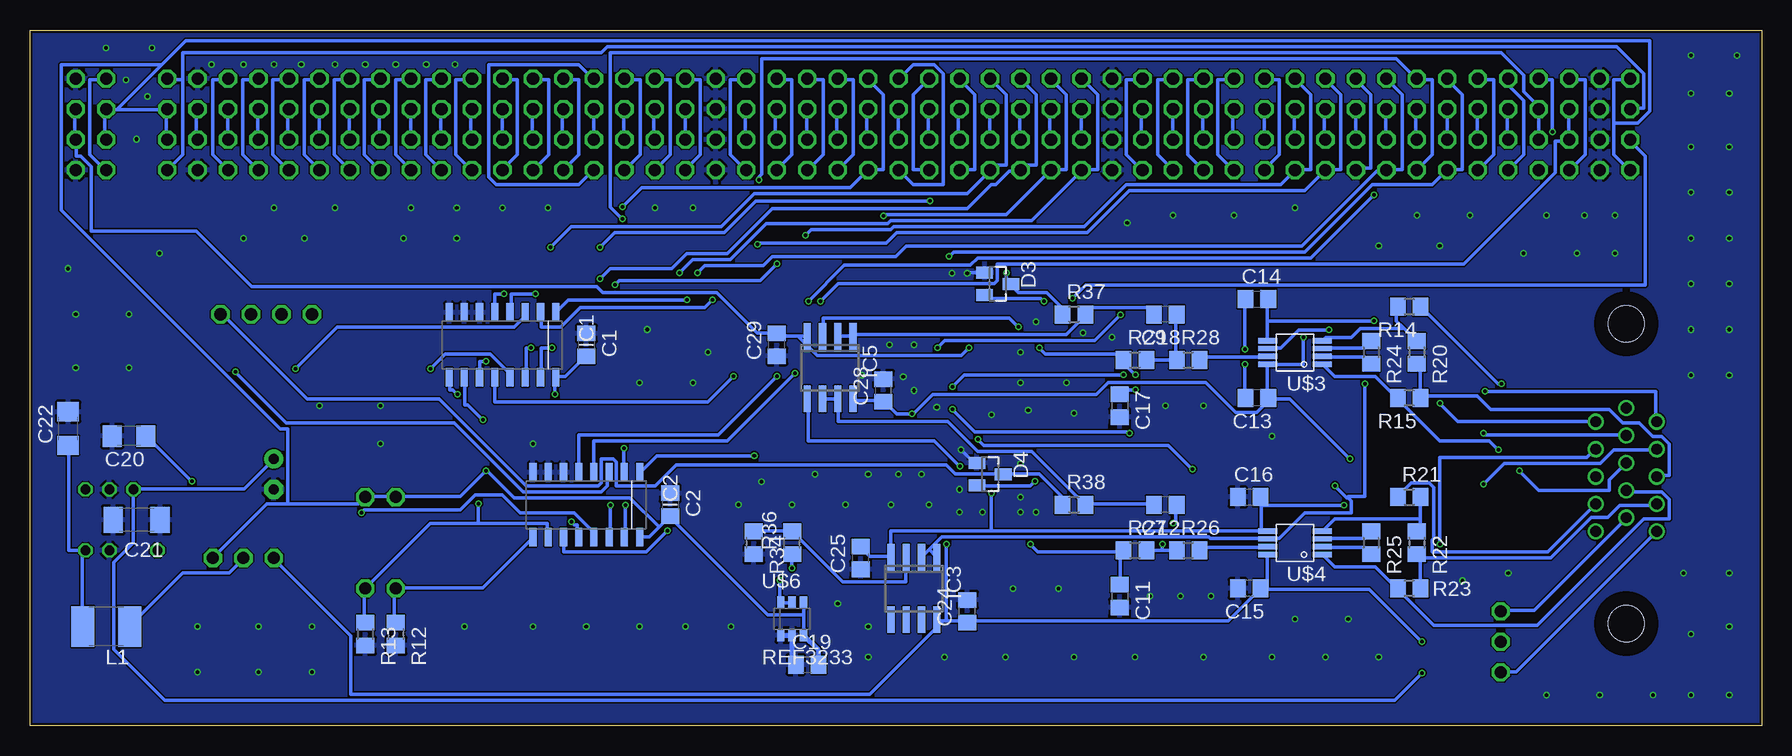
[diagram p6: board, bottom side, seen from below]

Size 144.32 x 58 mm. Coordinates in mm from the lower left corner, seen from the top.
Outline: 0,0 144.32,0 144.32,58 0,58 0,0
Copper layers (1*16): Top 0.018mm / dielectric 1.55mm / Bottom 0.018mm
Design rules "Multi-CB_2L_125um-Tracks_OL35um": minimum track width 0.125mm, minimum drill 0.2mm, track to track 0.125mm, track to pad 0.125mm, pad to pad 0.125mm, via to via 0.125mm, smd to smd 0mil, copper to edge 0.2mm, drill to drill 0.2mm, minimum pad ring 0.125mm, minimum via ring 0.125mm, stop-mask expansion 2mil, vias tented up to drill 0.45mm, thermal gap 0.2mm

### Footprints (pad centres in the part's own frame; a part is rotated, then mirrored left to right if it is on the bottom)
C0805 = smd 1.3 x 1.5: 1 -0.95,0; 2 0.95,0
C1206 = smd 1.6 x 1.8: 1 -1.4,0; 2 1.4,0
C1808 = smd 1.6 x 2.2: 1 -1.95,0; 2 1.95,0
E2,5-6 = drill 0.813 pad 1.6: + -1.27,0 | drill 0.813 pad 1.6 octagon: - 1.27,0
SOT23 = smd 1 x 1.4: 1 -0.95,-1.1; 2 0.95,-1.1; 3 0,1.1
TDN_XWI = drill 0.8 octagon: 1 2.54,3; 2 2.54,1; 4 2.54,-3; 5 -2.54,3; 6 -2.54,1; 7 -2.54,-1
EK-TM4C1294XL_BB+_NOMARK/90 = drill 1.016 octagon: 1 -60.96,-1.27; 2 -60.96,1.27; 3 -58.42,-1.27; 4 -58.42,1.27; 5 -55.88,-1.27; 6 -55.88,1.27; 7 -53.34,-1.27; 8 -53.34,1.27; 9 -50.8,-1.27; 10 -50.8,1.27; 11 -48.26,-1.27; 12 -48.26,1.27; 13 -45.72,-1.27; 14 -45.72,1.27; 15 -43.18,-1.27; 16 -43.18,1.27; 17 -40.64,-1.27; 18 -40.64,1.27; 19 -38.1,-1.27; 20 -38.1,1.27; 21 -35.56,-1.27; 22 -35.56,1.27; 23 -33.02,-1.27; 24 -33.02,1.27; 25 -30.48,-1.27; 26 -30.48,1.27; 27 -27.94,-1.27; 28 -27.94,1.27; 29 -25.4,-1.27; 30 -25.4,1.27; 31 -22.86,-1.27; 32 -22.86,1.27; 33 -20.32,-1.27; 34 -20.32,1.27; 35 -17.78,-1.27; 36 -17.78,1.27; 37 -15.24,-1.27; 38 -15.24,1.27; 39 -12.7,-1.27; 40 -12.7,1.27; 41 -10.16,-1.27; 42 -10.16,1.27; 43 -7.62,-1.27; 44 -7.62,1.27; 45 -5.08,-1.27; 46 -5.08,1.27; 47 -2.54,-1.27; 48 -2.54,1.27; 49 0,-1.27; 50 0,1.27; 51 2.54,-1.27; 52 2.54,1.27; 53 5.08,-1.27; 54 5.08,1.27; 55 7.62,-1.27; 56 7.62,1.27; 57 10.16,-1.27; 58 10.16,1.27; 59 12.7,-1.27; 60 12.7,1.27; 61 15.24,-1.27; 62 15.24,1.27; 63 17.78,-1.27; 64 17.78,1.27; 65 20.32,-1.27; 66 20.32,1.27; 67 22.86,-1.27; 68 22.86,1.27; 69 25.4,-1.27; 70 25.4,1.27; 71 27.94,-1.27; 72 27.94,1.27; 73 30.48,-1.27; 74 30.48,1.27; 75 33.02,-1.27; 76 33.02,1.27; 77 35.56,-1.27; 78 35.56,1.27; 79 38.1,-1.27; 80 38.1,1.27; 81 40.64,-1.27; 82 40.64,1.27; 83 43.18,-1.27; 84 43.18,1.27; 85 45.72,-1.27; 86 45.72,1.27; 87 48.26,-1.27; 88 48.26,1.27; 89 50.8,-1.27; 90 50.8,1.27; 91 53.34,-1.27; 92 53.34,1.27; 93 55.88,-1.27; 94 55.88,1.27; 95 58.42,-1.27; 96 58.42,1.27; 97 60.96,-1.27; 98 60.96,1.27; 99 66.04,-1.27; 100 66.04,1.27; 101 68.58,-1.27; 102 68.58,1.27
SOIC16_D = smd 0.6 x 1.55: 1 -4.445,-2.7; 2 -3.175,-2.7; 3 -1.905,-2.7; 4 -0.635,-2.7; 5 0.635,-2.7; 6 1.905,-2.7; 7 3.175,-2.7; 8 4.445,-2.7; 9 4.445,2.7; 10 3.175,2.7; 11 1.905,2.7; 12 0.635,2.7; 13 -0.635,2.7; 14 -1.905,2.7; 15 -3.175,2.7; 16 -4.445,2.7
SO08 = smd 0.6 x 2.2: 1 -1.905,-2.6; 2 -0.635,-2.6; 3 0.635,-2.6; 4 1.905,-2.6; 5 1.905,2.6; 6 0.635,2.6; 7 -0.635,2.6; 8 -1.905,2.6
1X1 = drill 1.016 octagon: 1 0,0
1X3 = drill 1.016 octagon: 1 -2.54,0; 2 0,0; 3 2.54,0
EK-TM4C1294XL_BB+ = drill 1.016 octagon: 1 -60.96,-1.27; 2 -60.96,1.27; 3 -58.42,-1.27; 4 -58.42,1.27; 5 -55.88,-1.27; 6 -55.88,1.27; 7 -53.34,-1.27; 8 -53.34,1.27; 9 -50.8,-1.27; 10 -50.8,1.27; 11 -48.26,-1.27; 12 -48.26,1.27; 13 -45.72,-1.27; 14 -45.72,1.27; 15 -43.18,-1.27; 16 -43.18,1.27; 17 -40.64,-1.27; 18 -40.64,1.27; 19 -38.1,-1.27; 20 -38.1,1.27; 21 -35.56,-1.27; 22 -35.56,1.27; 23 -33.02,-1.27; 24 -33.02,1.27; 25 -30.48,-1.27; 26 -30.48,1.27; 27 -27.94,-1.27; 28 -27.94,1.27; 29 -25.4,-1.27; 30 -25.4,1.27; 31 -22.86,-1.27; 32 -22.86,1.27; 33 -20.32,-1.27; 34 -20.32,1.27; 35 -17.78,-1.27; 36 -17.78,1.27; 37 -15.24,-1.27; 38 -15.24,1.27; 39 -12.7,-1.27; 40 -12.7,1.27; 41 -10.16,-1.27; 42 -10.16,1.27; 43 -7.62,-1.27; 44 -7.62,1.27; 45 -5.08,-1.27; 46 -5.08,1.27; 47 -2.54,-1.27; 48 -2.54,1.27; 49 0,-1.27; 50 0,1.27; 51 2.54,-1.27; 52 2.54,1.27; 53 5.08,-1.27; 54 5.08,1.27; 55 7.62,-1.27; 56 7.62,1.27; 57 10.16,-1.27; 58 10.16,1.27; 59 12.7,-1.27; 60 12.7,1.27; 61 15.24,-1.27; 62 15.24,1.27; 63 17.78,-1.27; 64 17.78,1.27; 65 20.32,-1.27; 66 20.32,1.27; 67 22.86,-1.27; 68 22.86,1.27; 69 25.4,-1.27; 70 25.4,1.27; 71 27.94,-1.27; 72 27.94,1.27; 73 30.48,-1.27; 74 30.48,1.27; 75 33.02,-1.27; 76 33.02,1.27; 77 35.56,-1.27; 78 35.56,1.27; 79 38.1,-1.27; 80 38.1,1.27; 81 40.64,-1.27; 82 40.64,1.27; 83 43.18,-1.27; 84 43.18,1.27; 85 45.72,-1.27; 86 45.72,1.27; 87 48.26,-1.27; 88 48.26,1.27; 89 50.8,-1.27; 90 50.8,1.27; 91 53.34,-1.27; 92 53.34,1.27; 93 55.88,-1.27; 94 55.88,1.27; 95 58.42,-1.27; 96 58.42,1.27; 97 60.96,-1.27; 98 60.96,1.27; 99 66.04,-1.27; 100 66.04,1.27; 101 68.58,-1.27; 102 68.58,1.27
L1812 = smd 1.9 x 3.4: 1 -1.95,0; 2 1.95,0
NT02 = drill 1.016 octagon: 1 -1.27,-3.81; 2 -1.27,3.81; 3 1.27,-3.81; 4 1.27,3.81
R0805 = smd 1.3 x 1.5: 1 -0.95,0; 2 0.95,0
DGK_S-PDSO-G8 = smd 0.45 x 1.6: 1 -0.975,-2.275; 2 -0.325,-2.275; 3 0.325,-2.275; 4 0.975,-2.275; 5 0.975,2.275; 6 0.325,2.275; 7 -0.325,2.275; 8 -0.975,2.275
SOT-23-6_DBV = smd 0.6 x 1.05: 1 -0.95,-1.35; 2 0,-1.35; 3 0.95,-1.35; 4 0.95,1.35; 5 0,1.35; 6 -0.95,1.35
HDM15H = drill 0.9: 1 -4.329,2.54; 2 -2.043,2.54; 3 0.243,2.54; 4 2.529,2.54; 5 4.815,2.54; 6 -5.472,0; 7 -3.186,0; 8 -0.9,0; 9 1.386,0; 10 3.672,0; 11 -4.329,-2.54; 12 -2.043,-2.54; 13 0.243,-2.54; 14 2.529,-2.54; 15 4.815,-2.54 | hole 3: -12.5,0; 12.5,0

### Placement (x,y rotation side)
C1  97.97,31.75 270 bottom
C2  90.98,18.41 270 bottom
C3  47.17,18.41 0 top
C4  45.26,23.5 0 top
C5  35.73,35.56 0 top
C6  35.73,29.21 180 top
C7  35.73,23.5 0 top
C8  35.73,17.14 180 top
C9  47.17,30.48 0 top
C10  45.26,35.56 0 top
C11  53.52,10.79 270 bottom
C12  49.7,18.41 180 bottom
C13  42.08,27.3 180 bottom
C14  42.08,35.56 0 bottom
C15  42.72,11.43 180 bottom
C16  42.72,19.05 0 bottom
C17  53.52,26.67 270 bottom
C18  49.7,34.29 180 bottom
C19  79.55,5.08 0 bottom
C20  136.06,24.13 180 bottom
C21  135.43,17.14 180 bottom
C22  141.14,24.77 90 bottom
C23  124,20.95 270 top
C24  66.22,9.53 90 bottom
C25  75.11,13.97 90 bottom
C26  72.56,24.77 90 top
C27  64.31,29.84 90 top
C28  73.2,27.94 90 bottom
C29  82.09,31.75 90 bottom
D1  56.69,33.66 90 top
D2  56.05,21.59 90 top
D3  63.67,36.83 270 bottom
D4  64.31,20.95 270 bottom
DCDC1  136.7,17.14 270 top
EK-TM4C1294XL  71.93,52.67 0 top
IC1  104.95,31.75 180 bottom
IC2  97.97,18.41 180 bottom
IC3  70.66,11.43 180 bottom
IC4  68.12,27.3 180 top
IC5  77.64,29.84 180 bottom
JP1  120.83,34.29 90 top
JP2  123.37,34.29 90 top
JP3  128.44,34.29 90 top
JP4  125.91,34.29 90 top
JP5  21.77,4.45 0 top
JP6  21.77,6.99 0 top
JP7  21.77,9.53 0 top
JP8  126.54,13.97 0 top
JP_EK-TM4C1294XL  71.93,47.59 0 top
L1  137.97,8.26 180 bottom
NT1  115.11,15.24 180 top
R1  28.11,27.94 90 top
R2  24.3,29.21 180 top
R3  23.67,34.29 90 top
R4  28.11,15.88 90 top
R5  24.3,17.14 180 top
R6  23.67,22.23 90 top
R7  26.21,32.38 90 top
R8  26.21,20.32 90 top
R9  26.21,4.45 180 top
R10  26.21,6.99 180 top
R11  26.21,9.53 180 top
R12  113.84,7.62 270 bottom
R13  116.38,7.62 270 bottom
R14  29.38,34.92 180 bottom
R15  29.38,27.3 180 bottom
R16  40.81,20.95 180 top
R17  45.26,20.95 180 top
R18  40.81,33.02 180 top
R19  45.26,33.02 180 top
R20  28.75,31.11 270 bottom
R21  29.38,19.05 0 bottom
R22  28.75,15.24 270 bottom
R23  29.38,11.43 180 bottom
R24  32.56,31.11 270 bottom
R25  32.56,15.24 270 bottom
R26  47.8,14.61 0 bottom
R27  52.25,14.61 0 bottom
R28  47.8,30.48 0 bottom
R29  52.25,30.48 0 bottom
R30  120.83,30.48 90 top
R31  123.37,30.48 270 top
R32  128.44,30.48 270 top
R33  125.91,30.48 90 top
R34  84,15.24 270 bottom
R35  52.25,22.23 90 top
R36  80.82,15.24 90 bottom
R37  57.33,34.29 0 bottom
R38  57.33,18.41 0 bottom
R39  52.25,34.29 90 top
U$1  31.93,32.38 270 top
U$2  31.93,20.32 270 top
U$3  38.91,31.11 90 bottom
U$4  38.91,15.24 90 bottom
U$6  80.82,8.89 0 bottom
X2  11.3,21 270 top

### Tracks (layer width: path | path; a pad name or v marks a point on that pad's centre or on a via)
+1V65
  Bottom 0.3: R34.1 83.95,16.25 80.83,16.25 R36.2 80.7,16.12 76.58,12 71.33,12 71.33,14 IC3.3
+3V3  (via drill 0.3)
  Top 0.3: 59.58,22.5 60.58,22.5 v60.58,20.38 | 59.58,22.5 57.2,22.5 D2.2 | JP_EK-TM4C1294XL.2 11.07,48.88 11.07,51.38 EK-TM4C1294XL.1 | 59.58,34.62 59.83,34.62 v59.83,35.38 | 59.58,34.62 57.83,34.62 D1.2 57.7,34.62 57.7,35.38 v57.45,35.62 | 59.58,34.62 59.58,22.5
  Bottom 0.3: 131.57,53.88 131.57,47.62 132.82,46.38 JP_EK-TM4C1294XL.97 | 131.57,53.88 132.82,53.88 EK-TM4C1294XL.98 | v60.58,20.38 60.95,20 65.33,20 D4.2 | v59.83,35.38 60.08,35.62 64.45,35.62 64.7,35.88 D3.2 | v57.45,35.62 56.33,36.75 9.7,36.75 9.7,47.5 10.95,48.75 JP_EK-TM4C1294XL.2 | 131.57,53.88 131.57,56.12 96.7,56.12 96.2,56.62 12.07,56.62 9.82,54.38 9.82,51.5 10.95,51.5 EK-TM4C1294XL.1
+24V  (via drill 0.3)
  Top 0.3: v28.32,4.38 27.2,4.38 R9.1
  Bottom 0.3: v28.32,4.38 30.57,2.12 133.07,2.12 137.32,6.38 137.32,13.62 135.7,15.25 DCDC1.7 135.57,19.75 126.45,19.75 124.08,22.12 C23.+
+VIN
  Bottom 0.3: C22.1 141.07,23.25 141.07,14.62 139.7,14.62 DCDC1.1 139.95,14.5 139.95,8.38 L1.2
AIN0+_I  (via drill 0.3)
  Top 0.3: R3.1 23.57,33.25 23.57,29.38 23.45,29.25 R2.2 23.32,29.12 23.32,28.12 v23.07,27.88
  Bottom 0.3: v23.07,27.88 8.82,27.88 8.82,25.38 X2.11
AIN0+_U  (via drill 0.3)
  Top 0.3: v26.82,26.88 28.07,26.88 R1.1
  Bottom 0.3: v26.82,26.88 25.32,25.38 13.95,25.38 X2.1
AIN0-
  Top 0.3: U$1.1 29.57,33.38 29.57,35.12 23.7,35.12 R3.2 23.57,35.12 23.57,35 19.82,35 11.32,26.5 X2.6
AIN1+_I  (via drill 0.3)
  Top 0.3: 23.57,20.38 23.57,21.25 R6.1 | 23.57,20.38 23.57,17.38 23.45,17.25 R5.2 | v23.2,20.12 23.45,20.38 23.57,20.38
  Bottom 0.3: v23.2,20.12 21.45,21.88 13.45,21.88 12.32,23 8.82,23 X2.12
AIN1+_U  (via drill 0.3)
  Top 0.3: v26.82,15.12 26.82,15 28.07,15 R4.1
  Bottom 0.3: v26.82,15.12 26.82,22.38 14.57,22.38 13.95,23 X2.2
AIN1-  (via drill 0.3)
  Top 0.3: U$2.1 29.57,21.38 29.57,23.12 23.7,23.12 R6.2 23.57,23.25 23.57,24 v23.2,24.38
  Bottom 0.3: v23.2,24.38 23.07,24.25 11.32,24.25 X2.7
AIN2+_I
  Bottom 0.3: R20.2 28.7,30.12 28.45,30.12 28.45,27.38 R15.1 28.32,27.5 23.7,27.5 22.57,26.38 12.7,26.38 11.57,25.25 10.2,25.25 9.07,24.12 8.32,24.12 7.7,23.5 7.7,20.88 8.7,20.88 X2.13
AIN2+_U  (via drill 0.3)
  Top 0.3: v21.7,28.5 13.95,20.75 X2.3
  Bottom 0.3: v21.7,28.5 21.95,28.5 28.32,34.88 R14.1
AIN2-  (via drill 0.3)
  Top 0.3: v21.95,23 v20.2,21.25
  Bottom 0.3: U$3.1 36.58,30.12 35.58,29.12 32.2,29.12 30.45,27.38 R15.2 30.32,27.25 26.82,23.75 22.7,23.75 v21.95,23 | X2.8 12.7,20.5 12.7,19.62 18.57,19.62 v20.2,21.25
AIN3+_I
  Bottom 0.3: R23.1 28.45,11.5 28.45,14.25 28.7,14.25 R22.2 28.32,14 17.57,14 14.2,17.38 12.82,17.38 11.82,18.38 8.82,18.38 X2.14
AIN3+_U
  Bottom 0.3: R21.1 30.32,19.12 29.2,20.25 27.7,20.25 27.32,19.88 27.32,15.62 27.45,15.5 27.45,14.5 17.82,14.5 13.95,18.38 X2.4
AIN3-
  Bottom 0.3: U$4.1 36.58,14.25 35.58,13.25 32.2,13.25 30.45,11.5 R23.2 30.32,11.38 27.32,8.38 18.7,8.38 9.82,17.25 7.7,17.25 7.7,18.88 8.32,19.5 11.2,19.5 X2.9
F_+5V  (via drill 0.3)
  Top 0.3: v100.58,27.62 106.33,21.88 v106.33,21.25
  Bottom 0.3: 91.89,16.56 92.7,15.75 93.45,15.75 IC2.16 | 91.89,16.56 91.08,17.38 C2.2 90.95,17.38 82.83,9.25 79.83,9.25 | 79.83,9.25 79.83,10.12 U$6.4 | 79.83,9.25 79.83,7.62 U$6.3 | C1.2 98.08,30.75 99.7,29.12 100.45,29.12 IC1.16 100.58,29 v100.58,27.62 | 122.83,18.5 116.95,18.5 116.45,19 NT1.1 116.33,19.12 113.95,19.12 NT1.3 113.83,19.12 108.45,19.12 v106.33,21.25 106.2,21.25 103.95,19 94.33,19 91.89,16.56 | 122.83,18.5 124.58,18.5 129.07,14 JP8.3 | 12.32,50.25 12.32,53.88 11.07,53.88 EK-TM4C1294XL.2 | 12.32,50.25 12.32,47.62 11.07,46.38 JP_EK-TM4C1294XL.1 | JP_EK-TM4C1294XL.98 132.95,48.88 132.95,51.38 EK-TM4C1294XL.97 133.07,51.38 136.95,51.38 | JP_EK-TM4C1294XL.100 138.07,48.88 138.07,51.38 EK-TM4C1294XL.99 137.82,51.38 136.95,51.38 | 12.32,50.25 10.32,50.25 9.32,51.25 9.32,57.12 131.32,57.12 133.39,55.06 | 133.39,55.06 136.95,51.5 136.95,51.38 | 122.83,18.5 122.83,24.75 123.45,24.75 141.7,43 141.7,55.12 133.45,55.12 133.39,55.06
  Bottom 0.406: C19.2 78.6,6.27 U$6.3
F_+12V  (via drill 0.3)
  Top 0.3: C26.1 72.45,23.88 70.08,23.88 70.08,24.62 IC4.8 | v70.83,26 70.08,25.25 70.08,24.75 IC4.8 | U$1.8 34.2,33.38 34.33,33.5 34.33,35.12 34.7,35.5 C5.1 34.83,35.62 36.58,37.38 37.95,37.38 37.95,37.12 38.33,36.75 38.33,34.25 38.2,34.12 v38.2,32.38 | C7.1 34.7,23.38 34.33,23 v34.33,22.25 34.33,21.5 34.2,21.38 U$2.8 | v28.32,7 27.2,7 R10.1 | JP_EK-TM4C1294XL.99 137.95,46.25 130.2,38.5 130.2,20.88 124.08,14.75 124.08,14 JP8.1 | v67.95,15.12 67.95,21.88 69.95,23.88 IC4.8
  Bottom 0.3: IC5.8 75.7,27.12 73.33,27.12 C28.1 73.08,27 72.08,26 v70.83,26 70.7,26 69.08,27.62 55.45,27.62 54.45,28.62 46.33,28.62 43.83,26.12 42.08,26.12 41.08,27.12 C13.1 | C13.1 41.2,27.38 41.2,30.12 U$3.8 41.08,30.12 38.2,30.12 v38.2,32.38 | v34.33,22.25 39.33,27.25 41.08,27.25 C13.1 | JP_EK-TM4C1294XL.99 138.07,46.38 139.32,47.62 139.32,53.88 138.07,53.88 EK-TM4C1294XL.100 | 68.33,8.75 68.7,8.75 IC3.8 | 68.33,8.75 67.95,8.75 | 67.95,8.75 66.45,8.75 66.33,8.62 C24.1 66.08,8.62 65.95,8.75 44.45,8.75 C15.1 | v28.32,7 32.7,11.38 41.7,11.38 C15.1 | U$4.8 41.2,14.25 41.2,11.5 C15.1 | JP8.1 123.95,13.88 117.58,7.5 117.58,2.62 74.33,2.62 68.33,8.62 68.33,8.75 | 67.95,8.75 v67.95,15.12
F_-12V  (via drill 0.3)
  Top 0.3: C6.2 33.45,27.88 32.45,27.88 | 32.45,29.75 32.45,27.88 | 32.45,29.75 34.08,31.38 34.2,31.38 U$1.5 | v32.33,33.75 32.33,29.75 32.45,29.75 | 34.33,18.38 34.33,19.12 34.2,19.25 U$2.5 34.08,19.38 33.2,19.38 32.33,20.25 32.33,27.62 32.45,27.75 32.45,27.88 | 34.33,18.38 34.33,17.62 34.7,17.25 C8.2 | v34.83,18.38 34.33,18.38 | C27.2 64.33,30.75 66.2,30.75 66.2,30 IC4.4 | v66.08,31.5 66.08,30.88 IC4.4 | IC4.4 66.08,29.88 66.08,27.16 63.53,27.16 62.41,26.04 62.41,21.17 v64.2,19.38
  Bottom 0.3: 41.2,33.75 41.2,32.12 U$3.5 | 41.2,33.75 41.2,35.5 C14.2 | v32.33,33.75 41.2,33.75 | C25.2 75.08,14.88 74.33,14.12 72.58,14.12 IC3.4 72.58,14.25 72.58,16.25 64.2,16.25 | v34.83,18.38 41.58,18.38 C16.2 41.7,19 41.7,16.25 41.2,16.25 U$4.5 41.83,16.25 64.2,16.25 | EK-TM4C1294XL.101 140.57,51.38 140.57,48.88 JP_EK-TM4C1294XL.102 140.45,48.75 140.45,47.5 140.07,47.5 139.2,46.62 139.2,41.25 130.45,41.25 125.83,36.62 97.08,36.62 96.58,36.12 87.08,36.12 83.7,32.75 82.2,32.75 C29.2 82.08,32.62 81.95,32.5 80.2,32.5 | 80.2,32.5 79.58,32.5 IC5.4 | v66.08,31.5 66.7,30.88 78.7,30.88 80.2,32.38 80.2,32.5 | v64.2,19.38 64.2,16.25
GND  (via drill 0.3)
  Bottom 0.3: v66.72,22.99 65.64,21.91 D4.1 | v66.22,37.72 66.15,37.78 D3.1
  Bottom 0.406: U$6.1 U$6.2 80.82,5.4 C19.1
  other vias: 31.93,5.71 36.37,5.71 40.81,5.71 46.53,5.71 52.25,5.71 57.33,5.71 63.04,5.71 34.47,8.89 38.91,8.89 74.47,5.71 74.47,8.26 85.9,8.26 89.71,8.26 93.52,8.26 97.97,8.26 102.41,8.26 108.12,8.26 120.83,4.45 125.27,4.45 130.35,4.45 130.35,8.26 125.27,8.26 120.83,8.26 140.51,29.84 140.51,34.29 136.06,34.29 136.06,29.84 120.19,26.67 115.11,26.67 115.11,23.5 102.41,23.5 93.52,28.57 89.08,28.57 87.81,31.11 92.89,33.02 108.76,40.64 113.2,40.64 121.46,40.64 126.54,40.64 62.41,11.43 58.59,11.43 48.44,10.79 45.89,10.79 50.97,10.79 24.94,12.06 21.13,12.7 49.7,26.67 46.53,26.67 40.81,24.13 57.33,26.04 61.77,28.57 57.96,28.57 61.77,31.11 54.15,32.38 60.5,33.66 56.56,32.77 68.12,5.71 77.01,10.16 76.38,18.41 72.56,18.41 69.39,18.41 70.03,20.95 74.47,20.95 78.92,20.95 80.82,18.41 85.27,18.41 83.36,20.32 17.95,2.54 13.51,2.54 9.06,2.54 5.89,2.54 2.71,2.54 5.89,7.62 2.71,8.26 2.71,12.7 6.52,12.7 5.89,29.21 2.71,29.21 2.71,33.02 5.89,33.02 5.89,36.83 2.71,36.83 5.89,40.64 2.71,40.64 2.71,44.45 5.89,44.45 5.89,48.26 2.71,48.26 2.71,52.7 5.89,52.7 5.89,55.88 2.08,55.88 12.24,39.37 15.41,39.37 19.86,39.37 17.95,42.55 14.78,42.55 12.24,42.55 24.3,42.55 28.75,42.55 26.84,40.01 31.93,40.01 38.91,43.18 43.99,42.55 49.07,42.55 52.88,41.91 89.08,43.18 92.25,43.18 101.14,43.18 104.95,43.18 108.76,43.18 112.57,43.18 118.92,43.18 124,43.18 141.14,38.1 133.53,39.37 134.16,56.52 137.97,56.52 135.43,48.9 136.32,53.85 134.54,52.45 129.21,55.12 126.54,55.12 124,55.12 121.71,55.12 118.92,55.12 116.38,55.12 113.84,55.12 111.3,55.12 108.89,55.12 67.48,37.72 66.85,19.68 66.85,17.78 64.94,17.78 61.77,17.78 60.5,17.78 61.77,19.05 71.93,20.95 61.77,21.84 70.66,27.94 71.55,29.08 70.66,31.75 72.69,31.75 74.98,29.21 68.75,26.54 61.14,26.29 64.18,25.91
  pour Bottom: 0,58 144.32,58 144.32,0 0,0
  pour Top: 0,58 144.32,58 144.32,0 0,0
MCU_ADC0
  Top 0.3: R39.1 52.33,33.38 52.33,33.62 55.58,33.62 D1.3 55.7,33.75 56.7,34.75 56.7,35.75 57.2,36.25 69.45,36.25 69.45,36 89.95,15.5 107.95,15.5 107.95,27.75 111.45,31.25 120.7,31.25 R30.2 120.95,31.5 120.95,34.25 JP1.1
MCU_ADC1
  Top 0.3: R35.1 52.33,21.38 52.33,21.5 54.95,21.5 D2.3 55.2,21.5 59.95,21.5 59.95,15.25 65.7,9.5 115.2,9.5 115.2,19.5 124.45,28.75 124.45,30.25 123.45,31.25 R31.1 123.45,31.5 123.45,34.25 JP2.1
MCU_ADC2  (via drill 0.3)
  Top 0.3: R33.2 125.95,31.5 125.95,34.25 JP4.1 125.7,34.5 114.95,45.25 85.7,45.25 85.7,46.75 84.95,47.5 62.95,47.5 v62.95,37.75
  Bottom 0.3: R37.1 58.33,34.38 58.33,34.88 59.58,36.12 61.95,36.12 62.58,36.75 D3.3 62.7,37 62.95,37 v62.95,37.75
MCU_ADC3
  Top 0.3: R32.1 128.45,31.5 128.45,34.25 JP3.1
  Bottom 0.3: R38.1 58.33,18.5 58.33,19.12 60.2,21 63.2,21 D4.3 63.45,21 67.2,21 67.95,21.75 90.45,21.75 92.2,20 95.45,20 95.45,22 95.7,22.25 96.7,22.25 96.7,20.25 96.95,20 102.95,20 110.2,27.25 121.2,27.25 128.2,34.25 JP3.1
N$1  (via drill 0.3)
  Top 0.3: C9.1 46.2,30.5 46.2,33 R19.1 46.33,32.75 49.7,32.75 v53.2,29.25 | v67.45,28.25 67.45,29.88 IC4.3
  Bottom 0.3: v67.45,28.25 66.45,29.25 v53.2,29.25
N$2
  Bottom 0.3: 29.89,33.19 30.45,33.75 30.45,34.88 R14.2 | 29.89,33.19 28.82,32.12 R20.1 | U$3.4 36.58,32.12 36.33,32.38 34.2,32.38 33.45,33.12 29.95,33.12 29.89,33.19
N$3
  Bottom 0.3: R24.1 32.58,32 33.08,31.5 36.58,31.5 U$3.3
N$4  (via drill 0.3)
  Top 0.3: v80.83,13.12 v81.83,12.12
  Bottom 0.3: U$6.5 81.7,10.25 U$6.6 81.83,10.38 v81.83,12.12 | v80.83,13.12 80.83,14.25 R36.1
N$5
  Bottom 0.3: R24.2 32.58,30.25 33.08,30.75 36.58,30.75 U$3.2
N$6  (via drill 0.3)
  Top 0.3: v43.08,31.38 v43.08,30.12
  Bottom 0.3: v43.08,30.12 43.08,27.38 C13.2 | v43.08,31.38 43.08,35.5 C14.1
N$7
  Bottom 0.3: R25.1 32.58,16.12 33.08,15.62 36.58,15.62 U$4.3
N$8
  Top 0.3: R7.1 26.32,31.5 28.45,31.5 28.45,31.75 28.7,32 29.57,32 U$1.3
N$9
  Top 0.3: R7.2 26.32,33.25 28.45,33.25 28.45,33 28.7,32.75 29.57,32.75 U$1.2
N$10
  Top 0.3: R8.1 26.32,19.38 28.45,19.38 28.45,19.75 28.7,20 29.57,20 U$2.3
N$11
  Top 0.3: R8.2 26.32,21.25 28.45,21.25 28.45,20.88 28.7,20.62 29.57,20.62 U$2.2
N$12
  Top 0.3: C6.1 36.7,29.25 36.7,35.5 C5.2
N$13
  Top 0.3: R5.1 25.32,17.12 28.07,17.12 28.07,16.88 R4.2 28.2,17.12 28.2,17.88 29.57,19.25 U$2.4
N$14
  Bottom 0.3: R25.2 32.58,14.38 33.08,14.88 36.58,14.88 U$4.2
N$15
  Bottom 0.3: 28.45,17.25 28.45,16.25 28.7,16.25 R22.1 | 28.45,17.25 28.45,19 R21.2 | 28.45,17.25 35.58,17.25 36.58,16.25 U$4.4
N$16
  Bottom 0.3: R26.2 46.83,14.62 46.58,14.88 41.2,14.88 U$4.7
N$17
  Top 0.3: R16.2 39.83,20.88 35.33,20.88 35.08,20.62 34.2,20.62 U$2.7
N$18
  Top 0.3: R16.1 41.83,21 44.2,21 R17.2 44.2,21.12 44.2,23.38 C4.1
N$19  (via drill 0.3)
  Top 0.3: v52.2,29.25 v52.2,28 | v60.2,31.5 v61.95,33.25
  Bottom 0.3: v52.2,28 53.08,28 53.45,27.62 C17.1 | v52.2,29.25 53.08,30.12 53.08,30.38 R29.1 53.33,30.5 53.83,31 59.7,31 v60.2,31.5 | v61.95,33.25 62.7,34 78.2,34 78.2,32.5 IC5.3
N$20
  Top 0.3: R18.2 39.83,33.12 38.83,34.12 38.83,37.25 38.2,37.88 32.95,37.88 32.95,33 33.2,32.75 34.2,32.75 U$1.7
N$21
  Top 0.3: R18.1 41.83,33 44.2,33 R19.2 44.33,33.12 44.33,35.5 C10.1
N$22  (via drill 0.3)
  Top 0.3: C3.1 46.2,18.5 46.2,20.88 R17.1 46.33,20.25 v47.45,21.38 | v65.33,23.88 65.45,23.88 66.2,24.62 IC4.5
  Bottom 0.3: v65.33,23.88 64.83,23.38 49.45,23.38 v47.45,21.38
N$23  (via drill 0.3)
  Top 0.3: v49.08,16.88 49.95,16 v49.95,15.12
  Bottom 0.3: 49.95,14.62 51.2,14.62 R27.2 | 49.95,14.62 48.83,14.62 R26.1 | v49.08,16.88 48.83,16.88 48.83,18.38 C12.1 | 49.95,14.62 v49.95,15.12
N$24  (via drill 0.3)
  Top 0.3: v130.82,20.38 126.45,16 126.45,14 JP8.2
  Bottom 0.3: v130.82,20.38 134.57,24.12 C20.1 | L1.1 135.95,8.38 131.57,12.75 127.7,12.75 126.58,13.88 JP8.2
N$25
  Bottom 0.3: R28.2 46.83,30.5 46.58,30.75 41.2,30.75 U$3.7
N$26
  Bottom 0.3: R29.2 51.2,30.5 48.83,30.5 R28.1 48.83,30.62 48.83,34.25 C18.1
N$27  (via drill 0.3)
  Top 0.3: v66.83,21.62 65.2,20 65.2,19.38 v60.95,15.12
  Bottom 0.3: C11.1 53.45,11.75 53.45,14.5 53.2,14.5 R27.1 53.58,14.5 60.33,14.5 v60.95,15.12 | v66.83,21.62 68.95,23.75 79.45,23.75 79.45,27.12 IC5.5
N$28  (via drill 0.3)
  Top 0.3: v110.95,29.75 120.7,29.75 R30.1
  Bottom 0.3: v110.95,29.75 109.7,31 105.95,31 104.2,29.25 IC1.13
N$29  (via drill 0.3)
  Top 0.3: v127.2,29.5 128.2,29.5 R32.2
  Bottom 0.3: v127.2,29.5 122.95,25.25 108.95,25.25 103.2,19.5 96.7,19.5 96.2,20 96.2,21 IC2.3
N$30  (via drill 0.3)
  Top 0.3: v122.2,29.75 123.2,29.75 R31.2
  Bottom 0.3: v122.2,29.75 118.7,33.25 103.95,33.25 102.95,34.25 IC1.3
N$31  (via drill 0.3)
  Top 0.3: v116.7,17.75 124.95,26 124.95,28.75 125.7,29.5 R33.1
  Bottom 0.3: v116.7,17.75 116.45,18 108.45,18 107.2,19.25 104.95,19.25 103.45,17.75 98.95,17.75 97.45,16.25 97.45,15.75 IC2.13
N$32
  Bottom 0.3: IC5.6 78.2,27.25 77.08,27.25 IC5.7 76.95,27.12 76.95,25.38 67.83,25.38 65.33,22.88 60.83,22.88 56.45,18.5 R38.2 56.33,18.5 50.7,18.5 C12.2
N$33
  Bottom 0.3: IC5.2 76.95,32.5 75.83,32.5 IC5.1 75.7,32.5 75.58,32.62 57.95,32.62 56.33,34.25 R37.2 56.33,34.38 55.83,34.88 51.2,34.88 50.7,34.38 C18.2
N$34
  Top 0.3: R2.1 25.32,29.12 28.07,29.12 28.07,29 R1.2 28.2,29.12 28.2,30 29.57,31.38 U$1.4
N$35  (via drill 0.3)
  Top 0.3: IC4.1 69.95,29.88 68.83,29.88 IC4.2 68.7,30 v68.7,31.5 | C10.2 46.33,35.5 52.2,35.5 52.2,35.25 R39.2 52.33,35.38 v53.45,34.25
  Bottom 0.3: v68.7,31.5 68.08,32.12 55.58,32.12 v53.45,34.25
N$36  (via drill 0.3)
  Top 0.3: IC4.7 68.7,24.75 67.58,24.75 IC4.6 67.58,24.88 67.45,25 v67.45,26.38 | C4.2 46.33,23.38 52.2,23.38 52.2,23.25 R35.2 52.33,23.38 52.33,24 v52.7,24.38
  Bottom 0.3: v67.45,26.38 65.58,24.5 52.83,24.5 v52.7,24.38
PA0
  Bottom 0.3: JP_EK-TM4C1294XL.73 102.33,46.38 101.08,47.62 101.08,53.88 102.33,53.88 EK-TM4C1294XL.74
PA1
  Bottom 0.3: JP_EK-TM4C1294XL.75 104.95,46.38 103.7,47.62 103.7,53.88 104.95,53.88 EK-TM4C1294XL.76
PA2
  Bottom 0.3: JP_EK-TM4C1294XL.5 15.95,46.38 14.7,47.62 14.7,53.88 15.95,53.88 EK-TM4C1294XL.6
PA3  (via drill 0.3)
  Top 0.3: v17.45,49.5 17.45,47.5 18.57,46.38 JP_EK-TM4C1294XL.7
  Bottom 0.3: v17.45,49.5 17.45,53.88 18.57,53.88 EK-TM4C1294XL.8
PA4
  Bottom 0.3: JP_EK-TM4C1294XL.9 21.07,46.38 19.82,47.62 19.82,52.12 21.07,53.38 21.07,53.88 EK-TM4C1294XL.10
PA5
  Bottom 0.3: JP_EK-TM4C1294XL.11 23.57,46.38 22.32,47.62 22.32,53.88 23.57,53.88 EK-TM4C1294XL.12
PA6
  Bottom 0.3: EK-TM4C1294XL.25 JP_EK-TM4C1294XL.26
PA7
  Bottom 0.3: JP_EK-TM4C1294XL.28 44.08,48.88 44.08,51.38 EK-TM4C1294XL.27
PB0
  Bottom 0.3: JP_EK-TM4C1294XL.57 82.08,46.38 80.83,47.62 80.83,53.88 82.08,53.88 EK-TM4C1294XL.58
PB1
  Bottom 0.3: JP_EK-TM4C1294XL.59 84.7,46.38 85.95,47.62 85.95,53.88 84.7,53.88 EK-TM4C1294XL.60
PB2
  Bottom 0.3: JP_EK-TM4C1294XL.68 94.83,48.88 94.83,51.38 EK-TM4C1294XL.67
PB3
  Bottom 0.3: JP_EK-TM4C1294XL.70 97.33,48.88 97.33,51.38 EK-TM4C1294XL.69
PB4  (via drill 0.3)
  Top 0.3: v94.7,18.38 87.95,25.12 87.95,25.88 v78.45,35.38
  Bottom 0.3: v94.7,18.38 94.7,15.75 IC2.15 | v78.45,35.38 76.95,36.88 63.95,36.88 63.7,37.12 63.7,38.5 24.82,38.5 17.2,46.12 17.2,48.75 16.07,48.75 JP_EK-TM4C1294XL.6 16.07,49 16.07,51.38 EK-TM4C1294XL.5
PB5  (via drill 0.3)
  Top 0.3: v94.83,23.12 94.95,23.25 v94.95,42.25
  Bottom 0.3: v94.83,23.12 94.83,21.12 IC2.2 | v94.95,42.25 95.95,43.25 95.95,56.12 21.7,56.12 19.82,54.25 19.82,52.88 18.7,51.75 18.7,51.5 EK-TM4C1294XL.7 18.57,51.25 18.57,48.88 JP_EK-TM4C1294XL.8
PC4
  Bottom 0.3: JP_EK-TM4C1294XL.24 38.95,48.88 38.95,51.38 EK-TM4C1294XL.23
PC5
  Bottom 0.3: JP_EK-TM4C1294XL.22 36.45,48.88 36.45,51.38 EK-TM4C1294XL.21
PC6
  Bottom 0.3: JP_EK-TM4C1294XL.20 33.83,48.88 33.83,51.38 EK-TM4C1294XL.19
PC7
  Bottom 0.3: JP_EK-TM4C1294XL.18 31.32,48.88 31.32,51.38 EK-TM4C1294XL.17
PD0  (via drill 0.3)
  Top 0.3: v80.58,29.38 71.83,38.12 71.83,46.25 JP_EK-TM4C1294XL.49
  Bottom 0.3: v80.58,29.38 86.2,23.75 97.33,23.75 97.33,21.12 IC2.4 | EK-TM4C1294XL.50 71.83,54 70.7,55.12 68.95,55.12 68.2,54.38 68.2,45.12 70.7,45.12 71.83,46.25 JP_EK-TM4C1294XL.49
PD1  (via drill 0.3)
  Top 0.3: v91.2,16.25 69.95,37.5 69.95,45.62 69.45,46.12 69.45,46.25 JP_EK-TM4C1294XL.47
  Bottom 0.3: v91.2,16.25 92.95,14.5 99.83,14.5 99.83,15.62 IC2.11 | EK-TM4C1294XL.48 69.45,53.88 70.7,52.62 70.7,46.38 69.45,46.38 JP_EK-TM4C1294XL.47
PD2  (via drill 0.3)
  Top 0.3: v94.95,43.25 v102.2,36
  Bottom 0.3: v102.2,36 104.2,36 104.2,34.5 IC1.4 | v94.95,43.25 93.33,44.88 75.95,44.88 74.58,46.25 JP_EK-TM4C1294XL.51 74.45,46.38 73.2,46.38 73.2,52.62 74.45,53.88 EK-TM4C1294XL.52
PD3  (via drill 0.3)
  Top 0.3: v96.83,39.88 v106.33,30.38 | v69.33,43.75 66.95,46.12 66.95,46.25 JP_EK-TM4C1294XL.45
  Bottom 0.3: v106.33,30.38 106.83,30.38 106.83,29.12 IC1.11 | v96.83,39.88 95.58,41.12 86.45,41.12 83.83,43.75 v69.33,43.75 | EK-TM4C1294XL.46 66.83,53.88 65.58,52.62 65.58,46.38 66.83,46.38 JP_EK-TM4C1294XL.45
PD4  (via drill 0.3)
  Top 0.3: v82.08,29.12 73.2,38 v73.2,42.5
  Bottom 0.3: v82.08,29.12 86.95,24.25 98.58,24.25 98.58,21.12 IC2.5 | v73.2,42.5 73.08,42.62 62.95,42.62 59.33,46.25 JP_EK-TM4C1294XL.39 59.2,46.38 57.95,46.38 57.95,52.62 59.2,53.88 EK-TM4C1294XL.40
PD5  (via drill 0.3)
  Top 0.3: v95.95,18.38 90.2,24.12 v90.2,37.75
  Bottom 0.3: v95.95,18.38 95.95,15.75 IC2.14 | v90.2,37.75 89.08,38.88 85.95,38.88 82.95,41.88 72.83,41.88 72.58,42.12 60.83,42.12 56.7,46.25 JP_EK-TM4C1294XL.37 56.58,46.38 55.33,46.38 55.33,52.62 56.58,53.88 EK-TM4C1294XL.38
PD6  (via drill 0.3)
  Top 0.3: v100.95,39.88 v104.83,36
  Bottom 0.3: v104.83,36 105.58,36 105.58,34.5 IC1.5 | v100.95,39.88 99.2,41.62 86.7,41.62 83.95,44.38 66.2,44.38 64.33,46.25 JP_EK-TM4C1294XL.43 64.2,46.38 63.83,46.75 62.95,46.75 62.95,52.62 64.2,53.88 EK-TM4C1294XL.44
PD7  (via drill 0.3)
  Top 0.3: v96.83,37.25 v102.58,31.5
  Bottom 0.3: v102.58,31.5 102.95,31.5 102.95,29.12 IC1.14 | v96.83,37.25 95.95,38.12 90.83,38.12 89.58,39.38 86.2,39.38 82.45,43.12 66.2,43.12 64.2,45.12 63.83,45.12 62.7,46.25 61.83,46.25 JP_EK-TM4C1294XL.41 61.7,46.38 61.33,46.75 60.45,46.75 60.45,52.62 61.7,53.88 EK-TM4C1294XL.42
PE0  (via drill 0.3)
  Top 0.3: v67.74,39.12 67.74,38.73 v83.97,22.5
  Bottom 0.3: v83.97,22.5 92.08,22.5 93.45,21.12 IC2.1 | EK-TM4C1294XL.14 26.2,53.88 24.95,52.62 24.95,46.38 26.07,46.38 JP_EK-TM4C1294XL.13 26.32,46.25 27.45,45.12 32.45,45.12 38.08,39.5 67.36,39.5 v67.74,39.12
PE1  (via drill 0.3)
  Top 0.3: v99.2,17 90.83,25.38 90.83,38.25 v83.58,45.5
  Bottom 0.3: v99.2,17 98.95,16.75 98.7,16.75 98.7,15.75 IC2.12 | v83.58,45.5 83.58,45.75 83.33,46 83.33,55.62 30.45,55.62 28.82,54 EK-TM4C1294XL.16 28.7,53.88 27.45,53.88 27.45,47.62 28.7,46.38 JP_EK-TM4C1294XL.15
PE2  (via drill 0.3)
  Top 0.3: v89.58,35.5 88.7,36.38 v88.7,37.75
  Bottom 0.3: v89.58,35.5 99.45,35.5 100.45,34.5 IC1.1 | v88.7,37.75 88.08,38.38 83.2,38.38 82.45,39.12 72.17,39.12 71.3,40 38.33,40 32.08,46.25 31.32,46.25 JP_EK-TM4C1294XL.17 31.2,46.38 29.95,46.38 29.95,52.62 31.2,53.88 EK-TM4C1294XL.18
PE3  (via drill 0.3)
  Top 0.3: v79.45,35.38 v85.7,29.12 | v32.33,44.25 33.83,45.75 33.83,46.25 JP_EK-TM4C1294XL.19
  Bottom 0.3: v85.7,29.12 87.83,27 105.58,27 105.58,29 IC1.12 | v79.45,35.38 76.45,38.38 65.95,38.38 65.33,39 37.58,39 v32.33,44.25 | EK-TM4C1294XL.20 33.83,53.88 32.58,52.62 32.58,46.5 33.7,46.5 33.83,46.38 JP_EK-TM4C1294XL.19
PE4  (via drill 0.3)
  Top 0.3: v87.45,35.5 84.08,38.88 83.7,38.88 v83.7,40.12
  Bottom 0.3: v87.45,35.5 88.08,34.88 98.45,34.88 100.08,33.25 101.7,33.25 101.7,34.38 IC1.2 | v83.7,40.12 83.58,40.25 72.95,40.25 72.08,41.12 56.2,41.12 52.7,44.62 38.08,44.62 36.45,46.25 JP_EK-TM4C1294XL.21 36.33,46.38 35.08,46.38 35.08,52.62 36.33,53.88 EK-TM4C1294XL.22
PE5  (via drill 0.3)
  Top 0.3: v95.58,36.75 v100.83,31.5 | v79.7,40.88 v82.08,38.5
  Bottom 0.3: v100.83,31.5 101.7,31.5 101.7,29.12 IC1.15 | v95.58,36.75 95.2,37.12 83.45,37.12 v82.08,38.5 | v79.7,40.88 79.2,41.38 72.58,41.38 72.33,41.62 56.45,41.62 52.95,45.12 40.08,45.12 38.95,46.25 JP_EK-TM4C1294XL.23 38.83,46.38 37.58,46.38 37.58,52.62 38.83,53.88 EK-TM4C1294XL.24
PF0
  Bottom 0.3: JP_EK-TM4C1294XL.65 92.2,46.38 90.95,47.62 90.95,53.88 92.2,53.88 EK-TM4C1294XL.66
PF1
  Bottom 0.3: JP_EK-TM4C1294XL.67 94.7,46.38 93.45,47.62 93.45,53.88 94.7,53.88 EK-TM4C1294XL.68
PF2
  Bottom 0.3: JP_EK-TM4C1294XL.69 97.45,46.25 98.58,45.12 105.45,45.12 106.08,45.75 106.08,55.12 98.58,55.12 97.45,54 EK-TM4C1294XL.70
PF3
  Bottom 0.3: JP_EK-TM4C1294XL.71 99.83,46.38 98.58,47.62 98.58,53.88 99.83,53.88 EK-TM4C1294XL.72
PF4
  Bottom 0.3: JP_EK-TM4C1294XL.63 89.7,46.38 88.45,47.62 88.45,53.88 89.7,53.88 EK-TM4C1294XL.64
PG0
  Bottom 0.3: JP_EK-TM4C1294XL.32 49.08,48.88 49.08,51.38 EK-TM4C1294XL.31
PG1
  Bottom 0.3: JP_EK-TM4C1294XL.30 46.58,48.88 46.58,51.38 EK-TM4C1294XL.29
PH0
  Bottom 0.3: JP_EK-TM4C1294XL.10 21.2,48.88 21.2,51.38 EK-TM4C1294XL.9
PH1
  Bottom 0.3: JP_EK-TM4C1294XL.12 23.7,48.88 23.7,51.38 EK-TM4C1294XL.11
PH2
  Bottom 0.3: JP_EK-TM4C1294XL.14 26.2,48.88 26.2,51.38 EK-TM4C1294XL.13
PH3
  Bottom 0.3: JP_EK-TM4C1294XL.16 28.82,48.88 28.82,51.38 EK-TM4C1294XL.15
PJ0
  Bottom 0.3: JP_EK-TM4C1294XL.81 112.58,46.38 113.83,47.62 113.83,53.88 112.58,53.88 EK-TM4C1294XL.82
PJ1
  Bottom 0.3: JP_EK-TM4C1294XL.83 115.2,46.38 116.45,47.62 116.45,53.88 115.2,53.88 EK-TM4C1294XL.84
PK0
  Bottom 0.3: JP_EK-TM4C1294XL.25 41.45,46.38 40.2,47.62 40.2,53.88 41.45,53.88 EK-TM4C1294XL.26
PK1
  Bottom 0.3: JP_EK-TM4C1294XL.27 44.08,46.38 45.33,47.62 45.33,53.88 44.08,53.88 EK-TM4C1294XL.28
PK2
  Bottom 0.3: JP_EK-TM4C1294XL.29 46.58,46.38 47.83,47.62 47.83,53.88 46.58,53.88 EK-TM4C1294XL.30
PK3
  Bottom 0.3: JP_EK-TM4C1294XL.31 49.08,46.38 50.33,47.62 50.33,53.88 49.08,53.88 EK-TM4C1294XL.32
PK4
  Bottom 0.3: JP_EK-TM4C1294XL.78 107.58,48.88 107.58,51.38 EK-TM4C1294XL.77
PK5
  Bottom 0.3: EK-TM4C1294XL.75 JP_EK-TM4C1294XL.76
PK6
  Bottom 0.3: JP_EK-TM4C1294XL.64 89.7,48.88 89.7,51.38 EK-TM4C1294XL.63
PK7
  Bottom 0.3: JP_EK-TM4C1294XL.60 84.7,48.88 84.7,51.38 EK-TM4C1294XL.59
PL0
  Bottom 0.3: JP_EK-TM4C1294XL.44 64.33,48.88 64.33,51.38 EK-TM4C1294XL.43
PL1
  Bottom 0.3: JP_EK-TM4C1294XL.46 66.95,48.88 66.95,51.38 EK-TM4C1294XL.45
PL2
  Bottom 0.3: JP_EK-TM4C1294XL.48 69.45,48.88 69.45,51.38 EK-TM4C1294XL.47
PL3
  Bottom 0.3: JP_EK-TM4C1294XL.50 71.95,48.88 71.95,51.38 EK-TM4C1294XL.49
PL4
  Bottom 0.3: JP_EK-TM4C1294XL.66 92.33,48.88 92.33,51.38 EK-TM4C1294XL.65
PL5
  Bottom 0.3: JP_EK-TM4C1294XL.80 110.08,48.88 110.08,51.38 EK-TM4C1294XL.79
PM0
  Bottom 0.3: JP_EK-TM4C1294XL.42 61.83,48.88 61.83,51.38 EK-TM4C1294XL.41
PM1
  Bottom 0.3: JP_EK-TM4C1294XL.40 59.33,48.88 59.33,51.38 EK-TM4C1294XL.39
PM2
  Bottom 0.3: JP_EK-TM4C1294XL.38 56.7,48.88 56.7,51.38 EK-TM4C1294XL.37
PM3
  Bottom 0.3: JP_EK-TM4C1294XL.34 51.7,48.88 51.7,51.38 EK-TM4C1294XL.33
PM4
  Bottom 0.3: JP_EK-TM4C1294XL.91 125.33,46.38 126.58,47.62 126.58,53.88 125.33,53.88 EK-TM4C1294XL.92
PM5
  Bottom 0.3: JP_EK-TM4C1294XL.89 122.83,46.38 124.08,47.62 124.08,53.88 122.83,53.88 EK-TM4C1294XL.90
PM6
  Bottom 0.3: JP_EK-TM4C1294XL.87 120.2,46.38 121.45,47.62 121.45,53.88 120.2,53.88 EK-TM4C1294XL.88
PM7
  Bottom 0.3: JP_EK-TM4C1294XL.85 117.7,46.38 118.95,47.62 118.95,53.88 117.7,53.88 EK-TM4C1294XL.86
PN0
  Bottom 0.3: JP_EK-TM4C1294XL.86 117.7,48.88 117.7,51.38 EK-TM4C1294XL.85
PN1
  Bottom 0.3: JP_EK-TM4C1294XL.88 120.2,48.88 120.2,51.38 EK-TM4C1294XL.87
PN2
  Bottom 0.3: JP_EK-TM4C1294XL.90 122.83,48.88 122.83,51.38 EK-TM4C1294XL.89
PN3
  Bottom 0.3: JP_EK-TM4C1294XL.92 125.33,48.88 125.33,51.38 EK-TM4C1294XL.91
PN4
  Bottom 0.3: JP_EK-TM4C1294XL.82 112.58,48.88 112.58,51.38 EK-TM4C1294XL.81
PN5
  Bottom 0.3: JP_EK-TM4C1294XL.84 115.2,48.88 115.2,51.38 EK-TM4C1294XL.83
PP0
  Bottom 0.3: JP_EK-TM4C1294XL.53 76.95,46.38 75.7,47.62 75.7,53.88 76.95,53.88 EK-TM4C1294XL.54
PP1
  Bottom 0.3: JP_EK-TM4C1294XL.55 79.45,46.38 78.2,47.62 78.2,53.88 79.45,53.88 EK-TM4C1294XL.56
PP2
  Bottom 0.3: JP_EK-TM4C1294XL.72 99.95,48.88 99.95,51.38 EK-TM4C1294XL.71
PP3
  Bottom 0.3: JP_EK-TM4C1294XL.74 102.45,48.88 102.45,51.38 EK-TM4C1294XL.73
PP4
  Bottom 0.3: JP_EK-TM4C1294XL.77 107.58,46.38 108.83,47.62 108.83,53.88 107.58,53.88 EK-TM4C1294XL.78
PP5
  Bottom 0.3: JP_EK-TM4C1294XL.79 110.08,46.38 111.33,47.62 111.33,53.88 110.08,53.88 EK-TM4C1294XL.80
PQ0
  Bottom 0.3: JP_EK-TM4C1294XL.52 74.58,48.88 74.58,51.38 EK-TM4C1294XL.51
PQ1
  Bottom 0.3: JP_EK-TM4C1294XL.54 77.08,48.88 77.08,51.38 EK-TM4C1294XL.53
PQ2
  Bottom 0.3: JP_EK-TM4C1294XL.56 79.58,48.88 79.58,51.38 EK-TM4C1294XL.55
PQ3
  Bottom 0.3: JP_EK-TM4C1294XL.58 82.2,48.88 82.2,51.38 EK-TM4C1294XL.57
PQ4
  Bottom 0.3: JP_EK-TM4C1294XL.94 127.83,48.88 127.83,51.38 EK-TM4C1294XL.93
REF  (via drill 0.3)
  Top 0.3: 35.2,32.12 v36.08,33 | 35.2,32.12 34.2,32.12 U$1.6 | v35.58,20 U$2.6 | v33.08,28.5 33.08,29.62 33.83,30.38 34.7,30.38 35.45,31.12 35.45,31.75 35.2,32 35.2,32.12
  Bottom 0.3: v36.08,33 38.58,33 40.08,31.5 41.08,31.5 U$3.6 | 69.39,14.69 69.95,14.12 IC3.2 | 69.39,14.69 68.33,15.75 46.08,15.75 45.95,15.62 41.2,15.62 U$4.6 41.08,15.62 40.2,15.62 38.08,17.75 34.2,17.75 34.2,18.75 34.45,19 | v35.58,20 34.58,19 34.45,19 | 69.39,14.69 68.83,14.12 IC3.1 | v33.08,28.5 33.08,19.12 34.45,19.12 34.45,19
RESET
  Bottom 0.3: JP_EK-TM4C1294XL.93 127.83,46.38 129.07,47.62 129.07,53.88 127.83,53.88 EK-TM4C1294XL.94
SUP_1
  Top 0.3: R9.2 25.2,4.38 21.82,4.38 JP5.1
  Bottom 0.3: X2.15 8.82,16.12 20.45,4.5 21.7,4.5 JP5.1
SUP_2
  Top 0.3: R10.2 25.2,6.88 21.82,6.88 JP6.1 21.7,6.88 19.95,8.62 19.95,10.12 13.95,16.12 X2.5
SUP_3
  Top 0.3: R11.2 25.2,9.62 21.82,9.62 JP7.1
  Bottom 0.3: X2.10 11.32,17.25 18.95,9.62 21.7,9.62 JP7.1
SW0  (via drill 0.3)
  Top 0.3: v106.58,25.5 106.95,25.12 v106.95,18.5
  Bottom 0.3: R13.1 116.45,8.62 116.45,11.38 NT1.2 116.33,11.5 110.95,16.88 106.95,16.88 | 106.95,16.88 101.2,16.88 101.2,15.75 IC2.10 | v106.58,25.5 107.83,26.75 108.08,26.75 108.08,29 IC1.10 | 106.95,16.88 v106.95,18.5
SW1  (via drill 0.3)
  Top 0.3: v108.7,27.62 112.08,24.25 112.08,13.75 113.83,12 113.83,11.5 NT1.4
  Bottom 0.3: R12.1 113.95,8.62 113.95,11.38 NT1.4 113.83,11.5 106.58,11.5 102.45,15.62 IC2.9 | v108.7,27.62 109.08,28 109.33,28 109.33,29 IC1.9
VREF
  Bottom 0.3: JP_EK-TM4C1294XL.33 51.7,46.38 52.95,47.62 52.95,53.88 51.7,53.88 EK-TM4C1294XL.34
WAKE
  Bottom 0.3: JP_EK-TM4C1294XL.96 130.45,48.88 130.45,51.38 EK-TM4C1294XL.95

### Text on the board
tNames: ADC0 | ADC1 | ADC2 | ADC3 | +12V | +5V | SUP_3 | SUP_2 | SUP_1 | Tim Schaake / Modulares Messsystem - Modul AnalogIN / Vers. 1.0